# EAGLE design RGBCUBE16v1.0 (EAGLE 5.11)
BOM: EXCLUDE; PARTNO: *

## Sheet 1 of 4
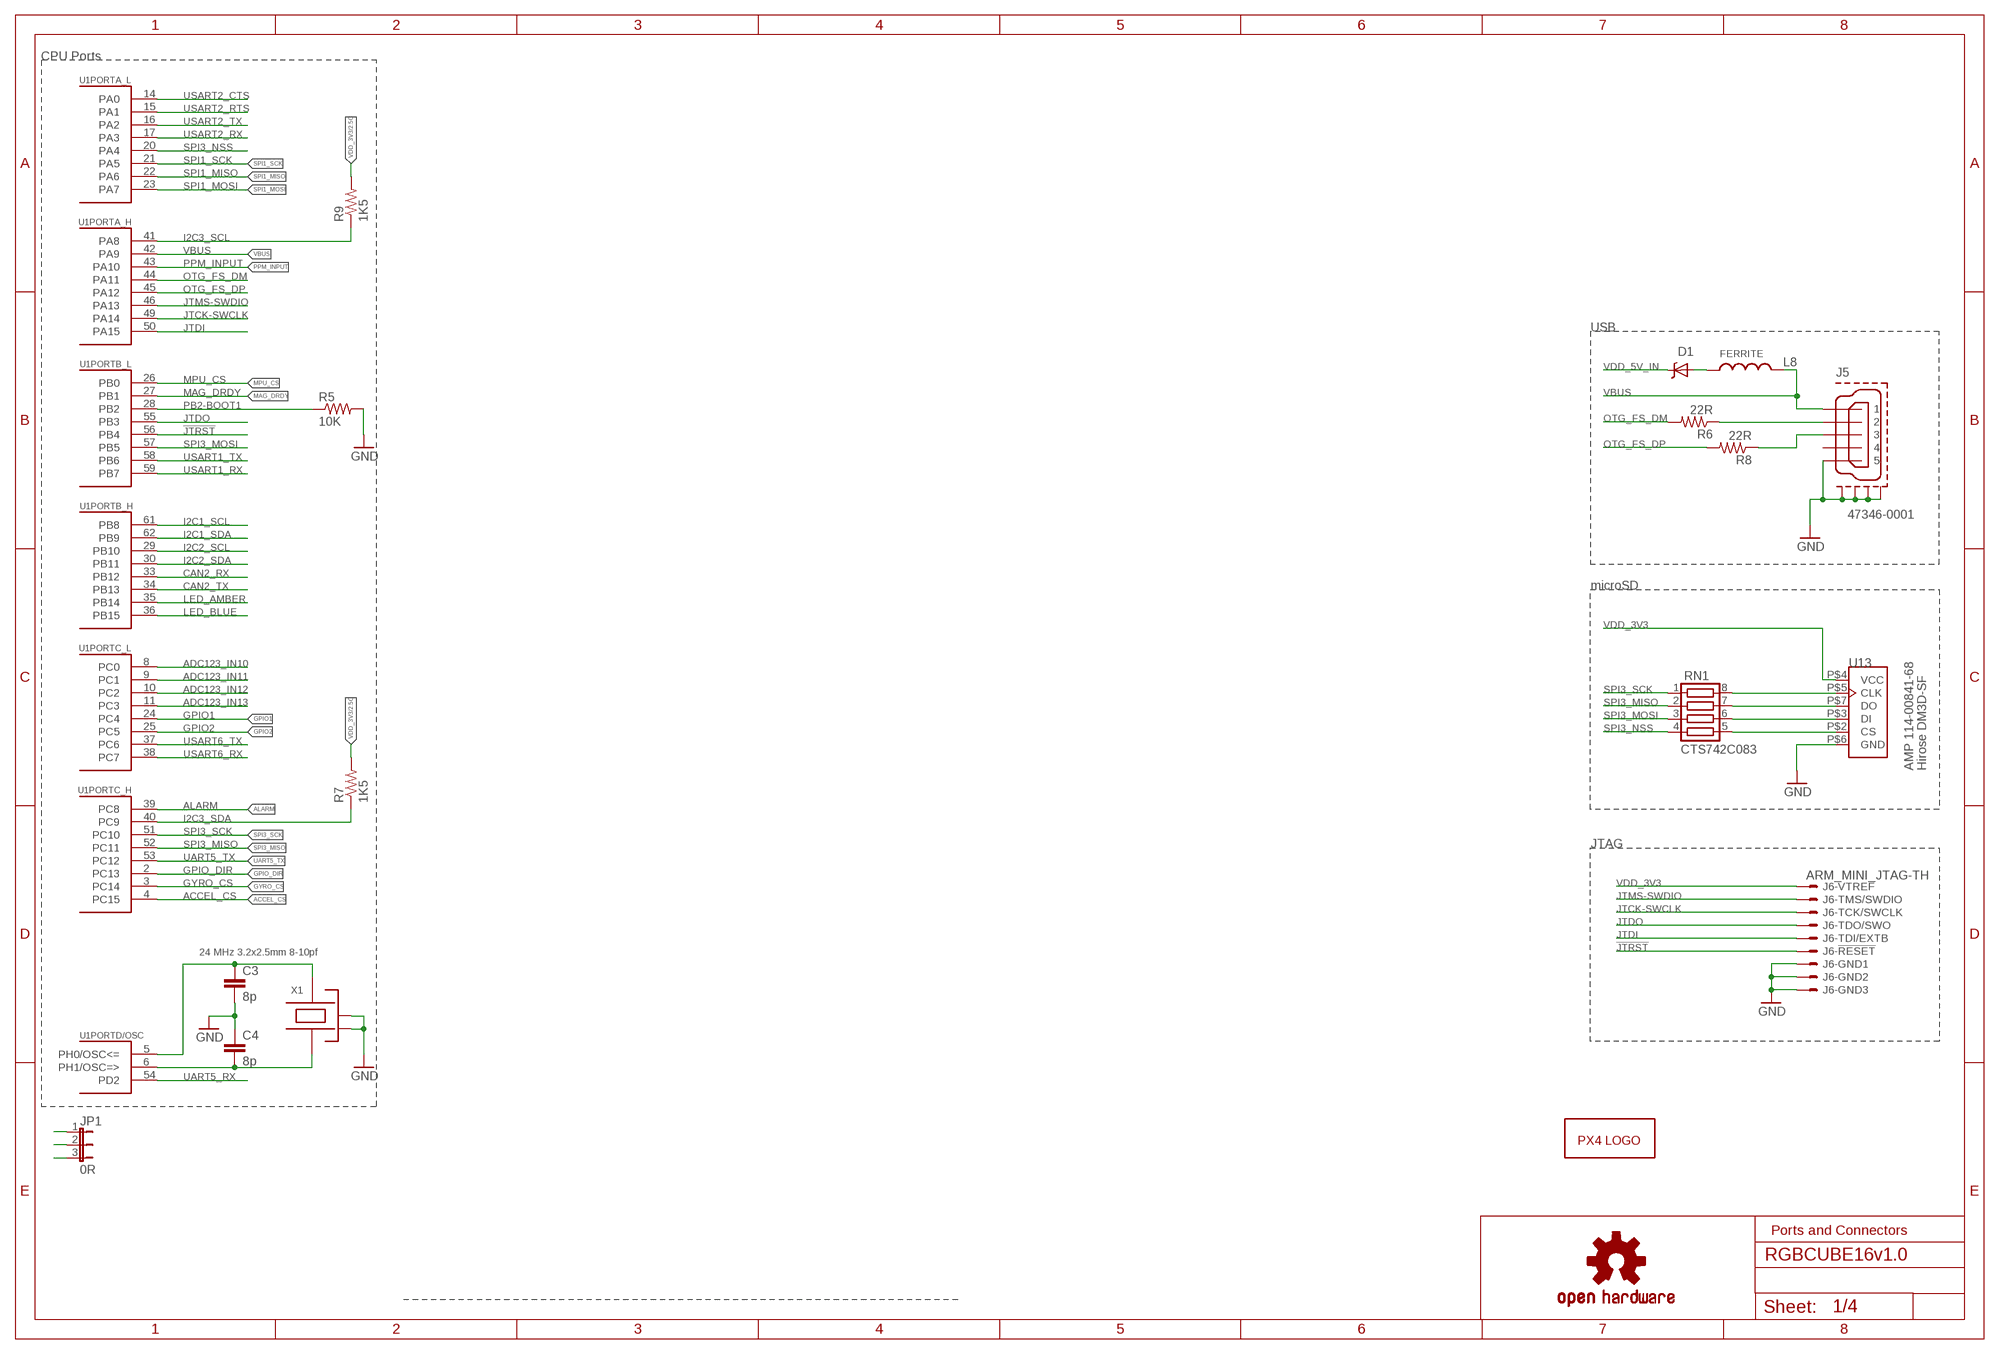
[diagram p0: schematic, sheet 1]

### Parts
C3  8p  CAP0402-CAP  [0402-CAP]
C4  8p  CAP0402-CAP  [0402-CAP]
D1  MSS1P4-M3  DIODE-SCHOTTKY_MSMP  [MICROSMP]
J5  47346-0001  MOLEX-47346-0001  [MOLEX-47346-0001]
J6  ARM_MINI_JTAG-TH  [FTSH-105-01-XXX-DV]
JP1  0R  JUMPER-30603  [SJ_3_0603_PASTE1&2]
L8  FERRITE  INDUCTOR0402  [0402-IND]
R5  10K  RESISTOR0402-RES  [0402-RES]
R6  22R  RESISTOR0402-RES  [0402-RES]
R7  1K5  RESISTOR0402-RES  [0402-RES]
R8  22R  RESISTOR0402-RES  [0402-RES]
R9  1K5  RESISTOR0402-RES  [0402-RES]
RN1  CTS742C083  [CTS742C083]
U1  STM32F405RGT6  STM32F20X_TQFP64  [TQFP64]
U13  AMP 114-00841-68  SF-MICROSDAMP-114-00841-68  [AMPHENOL_114-00841-68]
U$7  OSHW-LOGOS  [OSHW-LOGO-S]
U$13  PX4-LOGO-20MM  [PX4-LOGO-20MM]
X1  24 MHz 3.2x2.5mm 8-10pf  OSCILLATOR-3.2X2.5  [OSCILLATOR-3.2X2.5]

### Nets
!JTRST: J6.10 U1.56(PORTB_L:PB4)
ACCEL_CS: U1.4(PORTC_H:PC15)
ADC123_IN10: U1.8(PORTC_L:PC0)
ADC123_IN11: U1.9(PORTC_L:PC1)
ADC123_IN12: U1.10(PORTC_L:PC2)
ADC123_IN13: U1.11(PORTC_L:PC3)
ALARM: U1.39(PORTC_H:PC8)
CAN2_RX: U1.33(PORTB_H:PB12)
CAN2_TX: U1.34(PORTB_H:PB13)
GND [power]: C3.2 C4.1 J5.GND J5.GND1 J5.GND2 J5.GND3 J5.GND4 J6.3 J6.5 J6.9 R5.2 U13.P$6(GND) X1.2(NC_2) X1.4(NC_4) ; also sheet 2,3,4
GPIO1: U1.24(PORTC_L:PC4)
GPIO2: U1.25(PORTC_L:PC5)
GPIO_DIR: U1.2(PORTC_H:PC13)
GYRO_CS: U1.3(PORTC_H:PC14)
I2C1_SCL: U1.61(PORTB_H:PB8)
I2C1_SDA: U1.62(PORTB_H:PB9)
I2C2_SCL: U1.29(PORTB_H:PB10)
I2C2_SDA: U1.30(PORTB_H:PB11)
I2C3_SCL: R9.1 U1.41(PORTA_H:PA8)
I2C3_SDA: R7.1 U1.40(PORTC_H:PC9)
JTCK-SWCLK: J6.4 U1.49(PORTA_H:PA14)
JTDI: J6.8 U1.50(PORTA_H:PA15)
JTDO: J6.6 U1.55(PORTB_L:PB3)
JTMS-SWDIO: J6.2 U1.46(PORTA_H:PA13)
LED_AMBER: U1.35(PORTB_H:PB14) ; also sheet 2
LED_BLUE: U1.36(PORTB_H:PB15) ; also sheet 2
MAG_DRDY: U1.27(PORTB_L:PB1)
MPU_CS: U1.26(PORTB_L:PB0)
N$1: C4.2 U1.6(PORTD/OSC:PH1/OSC=>) X1.1
N$2: C3.1 U1.5(PORTD/OSC:PH0/OSC<=) X1.3
N$21: RN1.5 U13.P$2(CS)
N$23 [power]: D1.ANODE(A) L8.1
N$26: RN1.6 U13.P$3(DI)
N$31: RN1.7 U13.P$7(DO)
N$32: RN1.8 U13.P$5(CLK)
OTG_DM: J5.D- R6.1
OTG_DP: J5.D+ R8.1
OTG_FS_DM: R6.2 U1.44(PORTA_H:PA11)
OTG_FS_DP: R8.2 U1.45(PORTA_H:PA12)
PB2-BOOT1: R5.1 U1.28(PORTB_L:PB2)
PPM_INPUT: U1.43(PORTA_H:PA10)
SPI1_MISO: U1.22(PORTA_L:PA6)
SPI1_MOSI: U1.23(PORTA_L:PA7)
SPI1_SCK: U1.21(PORTA_L:PA5)
SPI3_MISO: RN1.2 U1.52(PORTC_H:PC11)
SPI3_MOSI: RN1.3 U1.57(PORTB_L:PB5)
SPI3_NSS: RN1.4 U1.20(PORTA_L:PA4)
SPI3_SCK: RN1.1 U1.51(PORTC_H:PC10)
UART5_RX: U1.54(PORTD/OSC:PD2)
UART5_TX: U1.53(PORTC_H:PC12)
USART1_RX: U1.59(PORTB_L:PB7)
USART1_TX: U1.58(PORTB_L:PB6)
USART2_CTS: U1.14(PORTA_L:PA0)
USART2_RTS: U1.15(PORTA_L:PA1)
USART2_RX: U1.17(PORTA_L:PA3)
USART2_TX: U1.16(PORTA_L:PA2)
USART6_RX: U1.38(PORTC_L:PC7)
USART6_TX: U1.37(PORTC_L:PC6)
VBUS [power]: J5.VBUS L8.2 U1.42(PORTA_H:PA9)
VDD_3V3 [power]: J6.1 JP1.1 R7.2 R9.2 U13.P$4(VCC) ; also sheet 2
VDD_5V [power]: JP1.3 ; also sheet 2,3,4
VDD_5V_IN [power]: D1.CATHODE(C) ; also sheet 2
VDD_IO [power]: JP1.2
Unconnected: J5.ID

### Notes on the sheet
- CPU Ports
- USB
- microSD
- Hirose DM3D-SF
- JTAG
- Ports and Connectors

## Sheet 2 of 4
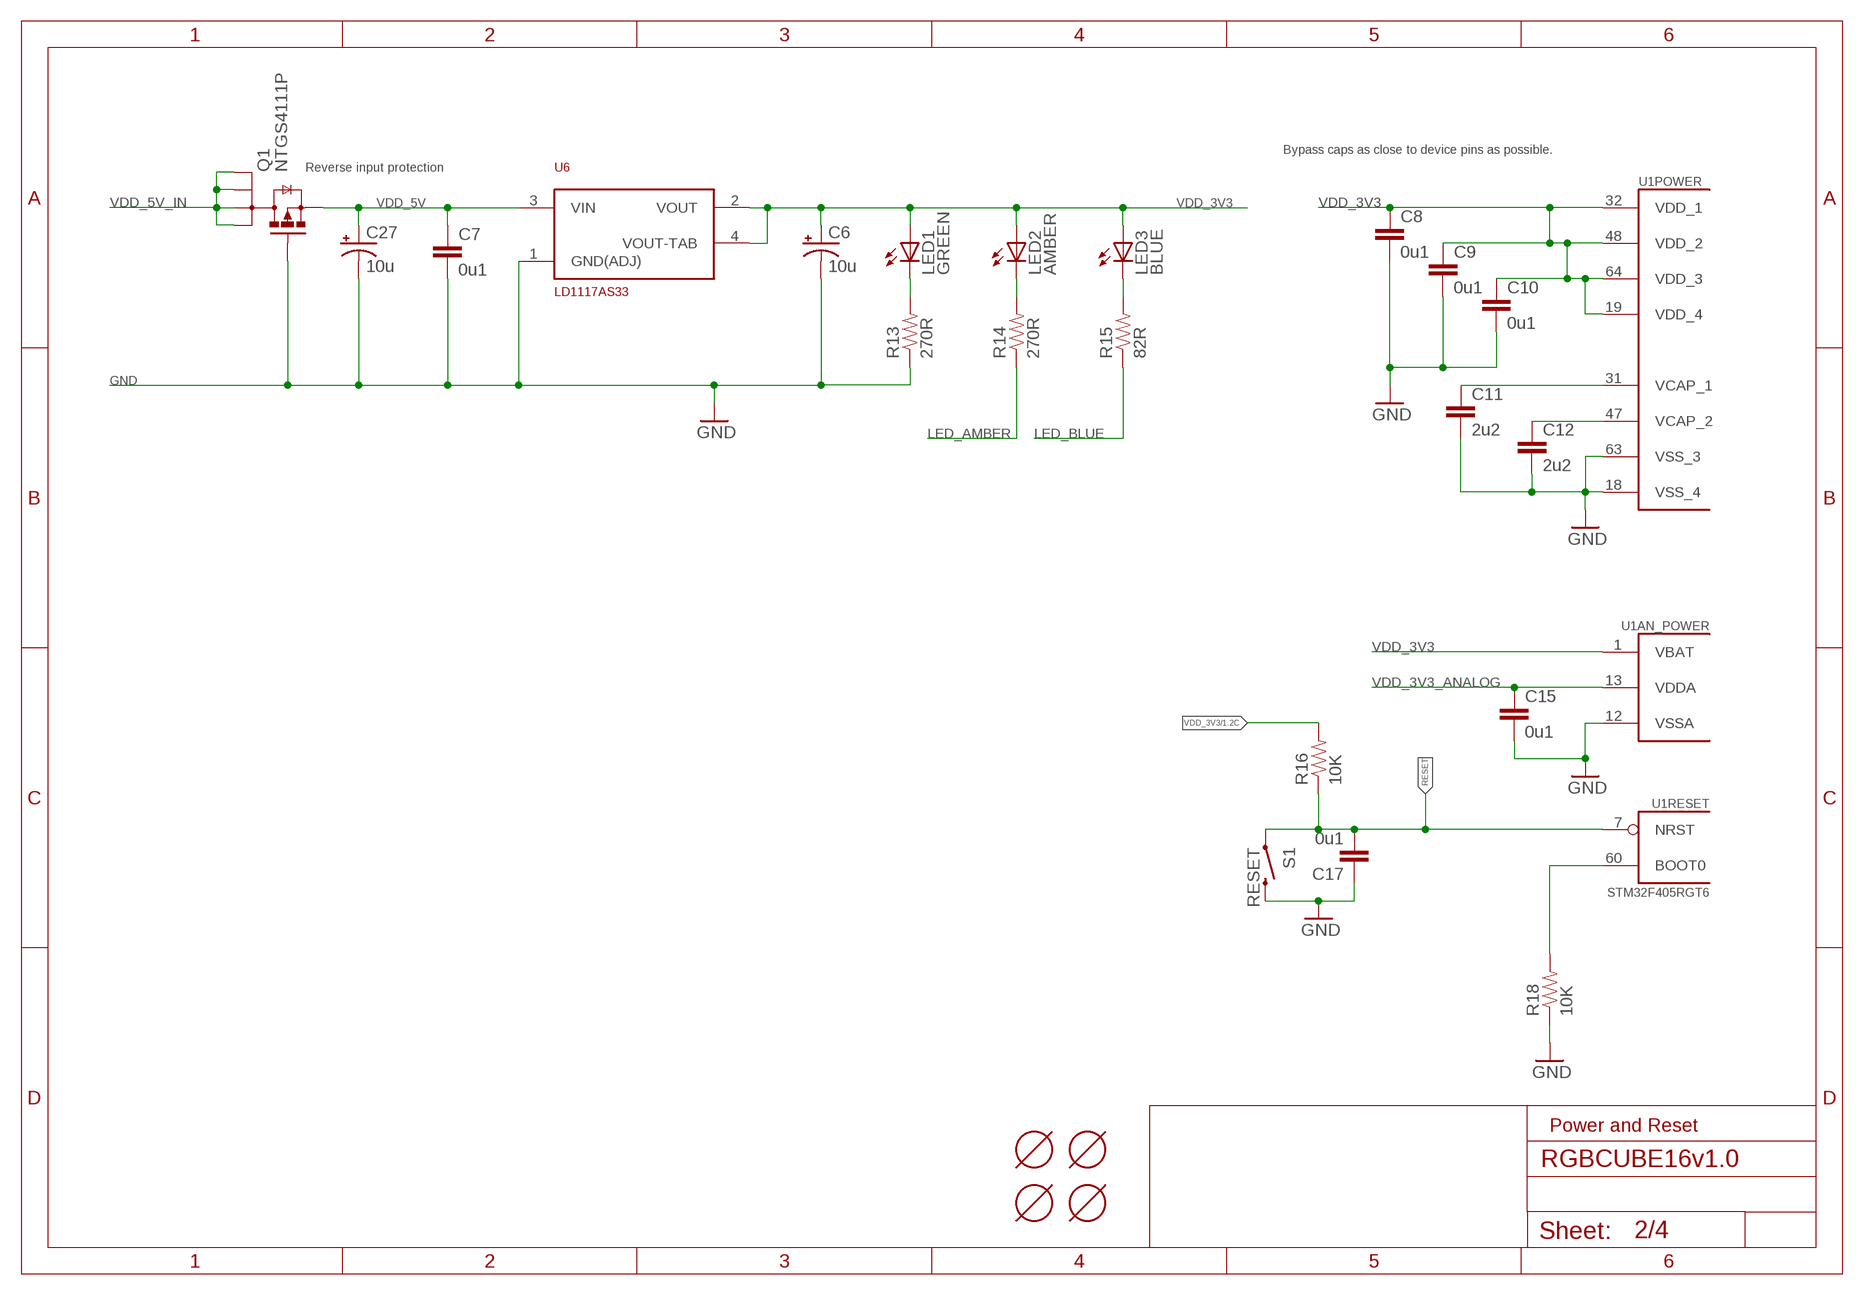
[diagram p1: schematic, sheet 2]

### Parts
C6  10u  CAP_POL1206  [EIA3216]
C7  0u1  CAP0402-CAP  [0402-CAP]
C8  0u1  CAP0402-CAP  [0402-CAP]
C9  0u1  CAP0402-CAP  [0402-CAP]
C10  0u1  CAP0402-CAP  [0402-CAP]
C11  2u2  CAP0402-CAP  [0402-CAP]
C12  2u2  CAP0402-CAP  [0402-CAP]
C15  0u1  CAP0402-CAP  [0402-CAP]
C17  0u1  CAP0402-CAP  [0402-CAP]
C27  10u  CAP_POL1206  [EIA3216]
LED1  GREEN  LED0603  [LED-0603]
LED2  AMBER  LED0603  [LED-0603]
LED3  BLUE  LED0603  [LED-0603]
Q1  NTGS4111P  [TSOP-6]
R13  270R  RESISTOR0402-RES  [0402-RES]
R14  270R  RESISTOR0402-RES  [0402-RES]
R15  82R  RESISTOR0402-RES  [0402-RES]
R16  10K  RESISTOR0402-RES  [0402-RES]
R18  10K  RESISTOR0402-RES  [0402-RES]
S1  RESET  SWITCH-MOMENTARY-2  [EVQP7J01K]
U6  LD1117AS33  [SOT-223]
U$1  MOUNT-HOLE3.1MM  [MOUNT-HOLE3.1]
U$2  MOUNT-HOLE3.1MM  [MOUNT-HOLE3.1]
U$3  MOUNT-HOLE3.1MM  [MOUNT-HOLE3.1]
U$4  MOUNT-HOLE3.1MM  [MOUNT-HOLE3.1]

### Nets
BOOT0: R18.2 U1.60(RESET:BOOT0)
GND [power]: C6.C(-) C7.2 C8.2 C9.2 C10.2 C11.2 C12.2 C15.2 C17.1 C27.C(-) Q1.3(G) R13.1 R18.1 S1.B3 U1.12(AN_POWER:VSSA) U1.18(POWER:VSS_4) U1.63(POWER:VSS_3) U6.1(GND(ADJ)) ; also sheet 1,3,4
LED_AMBER: R14.1 ; also sheet 1
LED_BLUE: R15.1 ; also sheet 1
N$28: LED3.C R15.2
N$29: LED1.C R13.2
N$30: LED2.C R14.2
RESET: C17.2 R16.1 S1.A1 U1.7(RESET:NRST)
VCAP_1: C11.1 U1.31(POWER:VCAP_1)
VCAP_2: C12.1 U1.47(POWER:VCAP_2)
VDD_3V3 [power]: C6.A(+) C8.1 C9.1 C10.1 LED1.A LED2.A LED3.A R16.2 U1.1(AN_POWER:VBAT) U1.19(POWER:VDD_4) U1.32(POWER:VDD_1) U1.48(POWER:VDD_2) U1.64(POWER:VDD_3) U6.2(VOUT) U6.4(VOUT-TAB) ; also sheet 1
VDD_3V3_ANALOG [power]: C15.1 U1.13(AN_POWER:VDDA)
VDD_5V [power]: C7.1 C27.A(+) Q1.4(S) U6.3(VIN) ; also sheet 1,3,4
VDD_5V_IN [power]: Q1.1(D) Q1.2(D1) Q1.5(D2) Q1.6(D3) ; also sheet 1

### Notes on the sheet
- Bypass caps as close to device pins as possible.
- Reverse input protection
- Power and Reset

## Sheet 3 of 4
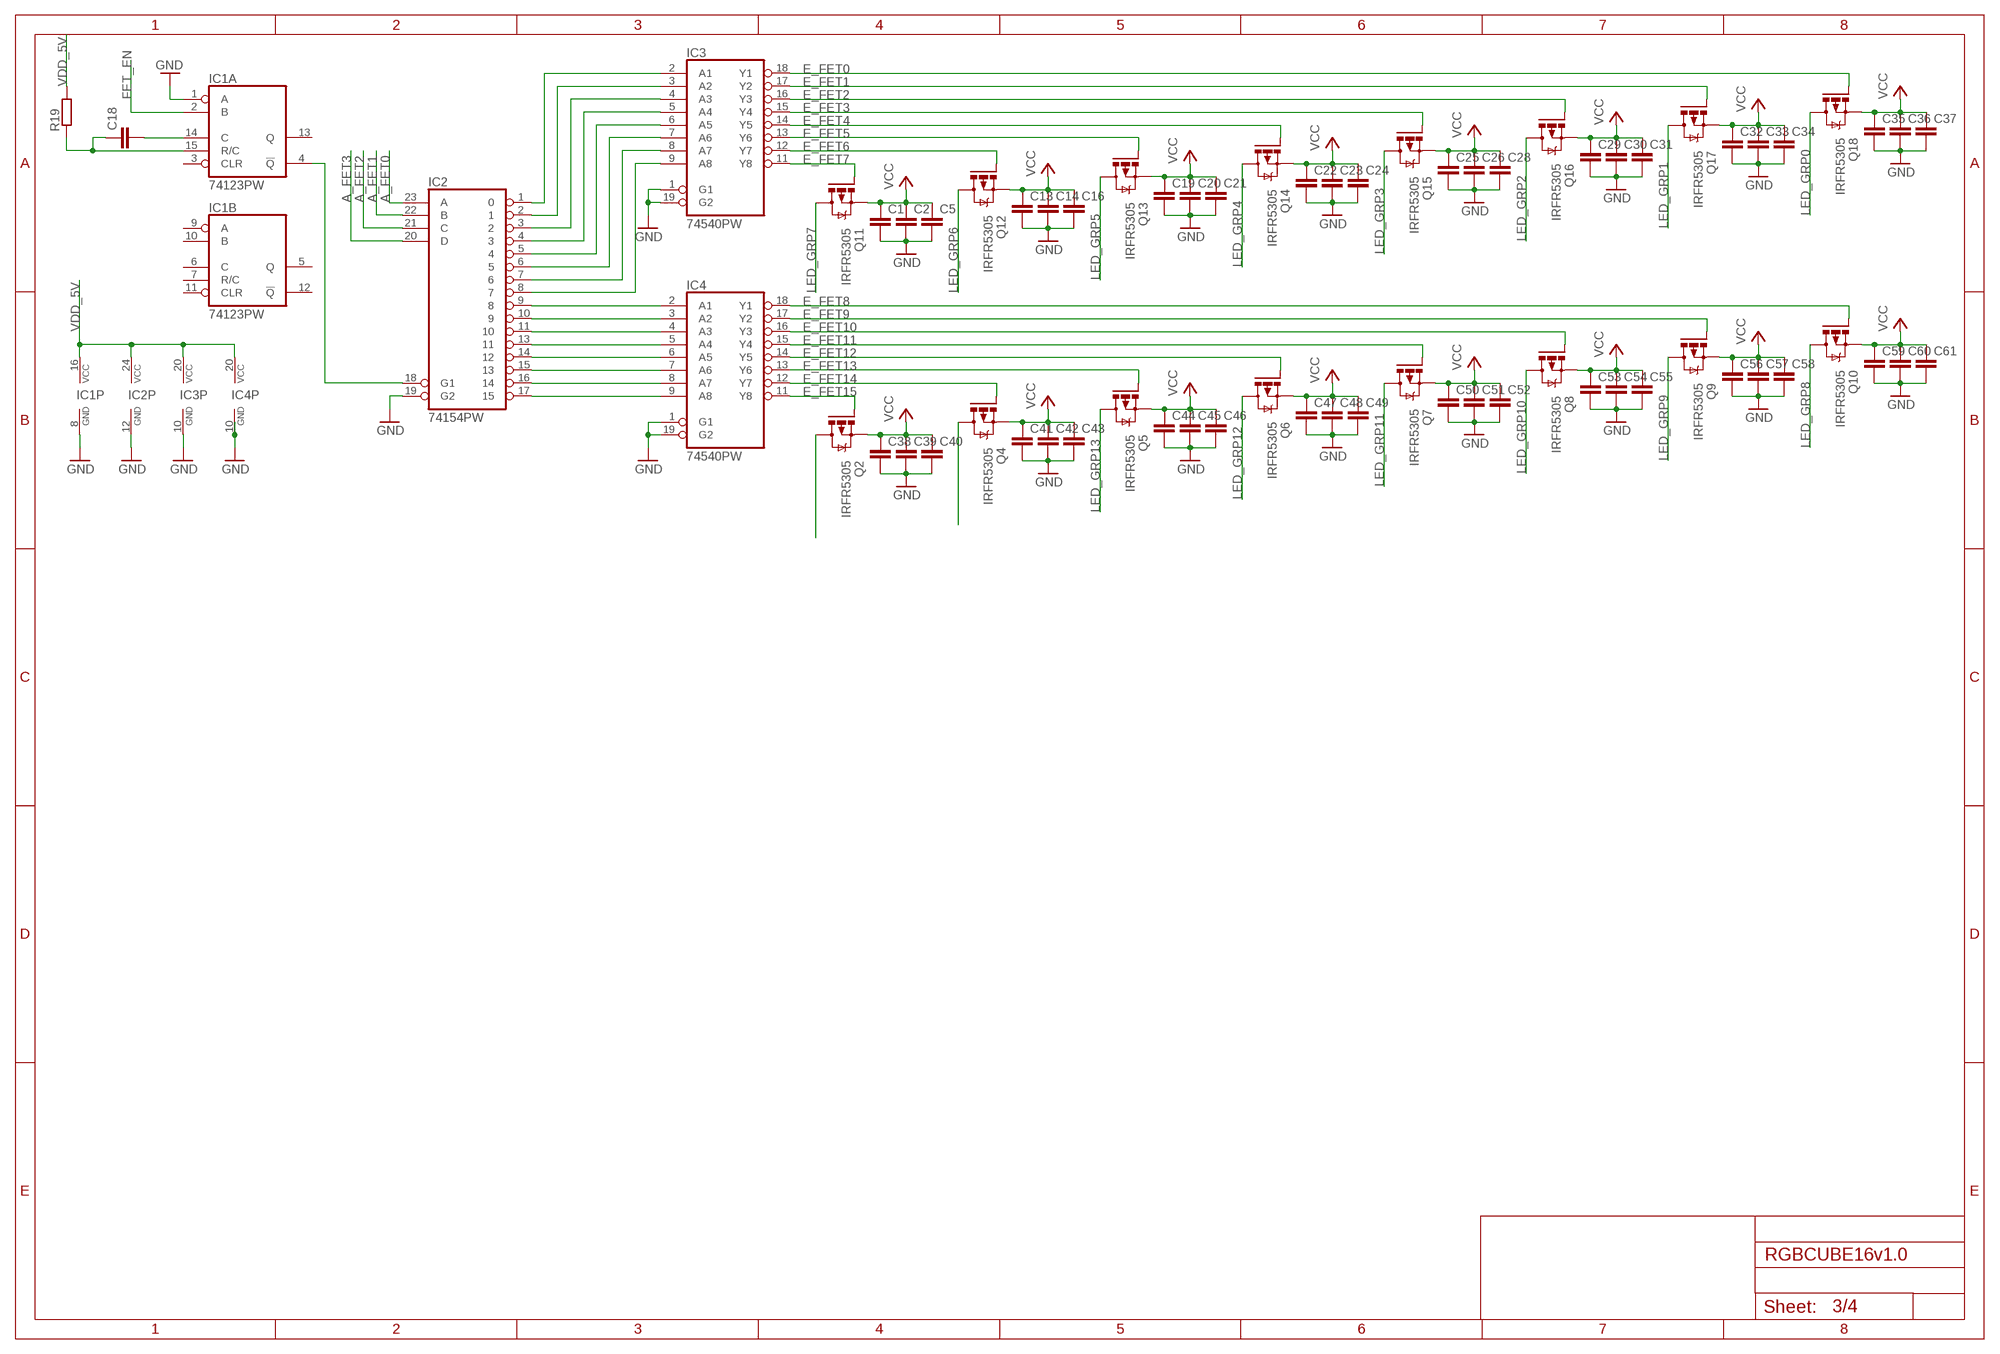
[diagram p2: schematic, sheet 3]

### Parts
C1  CAP0805  [0805]
C2  CAP0805  [0805]
C5  CAP0805  [0805]
C13  CAP0805  [0805]
C14  CAP0805  [0805]
C16  CAP0805  [0805]
C18  C-EUC0402  [C0402]
C19  CAP0805  [0805]
C20  CAP0805  [0805]
C21  CAP0805  [0805]
C22  CAP0805  [0805]
C23  CAP0805  [0805]
C24  CAP0805  [0805]
C25  CAP0805  [0805]
C26  CAP0805  [0805]
C28  CAP0805  [0805]
C29  CAP0805  [0805]
C30  CAP0805  [0805]
C31  CAP0805  [0805]
C32  CAP0805  [0805]
C33  CAP0805  [0805]
C34  CAP0805  [0805]
C35  CAP0805  [0805]
C36  CAP0805  [0805]
C37  CAP0805  [0805]
C38  CAP0805  [0805]
C39  CAP0805  [0805]
C40  CAP0805  [0805]
C41  CAP0805  [0805]
C42  CAP0805  [0805]
C43  CAP0805  [0805]
C44  CAP0805  [0805]
C45  CAP0805  [0805]
C46  CAP0805  [0805]
C47  CAP0805  [0805]
C48  CAP0805  [0805]
C49  CAP0805  [0805]
C50  CAP0805  [0805]
C51  CAP0805  [0805]
C52  CAP0805  [0805]
C53  CAP0805  [0805]
C54  CAP0805  [0805]
C55  CAP0805  [0805]
C56  CAP0805  [0805]
C57  CAP0805  [0805]
C58  CAP0805  [0805]
C59  CAP0805  [0805]
C60  CAP0805  [0805]
C61  CAP0805  [0805]
IC1  74123PW  [TSSOP-16]
IC2  74154PW  [TSSOP-24]
IC3  74540PW  [TSSOP-20]
IC4  74540PW  [TSSOP-20]
Q2  IRFR5305  [D-PAK_TO252AA]
Q4  IRFR5305  [D-PAK_TO252AA]
Q5  IRFR5305  [D-PAK_TO252AA]
Q6  IRFR5305  [D-PAK_TO252AA]
Q7  IRFR5305  [D-PAK_TO252AA]
Q8  IRFR5305  [D-PAK_TO252AA]
Q9  IRFR5305  [D-PAK_TO252AA]
Q10  IRFR5305  [D-PAK_TO252AA]
Q11  IRFR5305  [D-PAK_TO252AA]
Q12  IRFR5305  [D-PAK_TO252AA]
Q13  IRFR5305  [D-PAK_TO252AA]
Q14  IRFR5305  [D-PAK_TO252AA]
Q15  IRFR5305  [D-PAK_TO252AA]
Q16  IRFR5305  [D-PAK_TO252AA]
Q17  IRFR5305  [D-PAK_TO252AA]
Q18  IRFR5305  [D-PAK_TO252AA]
R19  R-EU_R0402  [R0402]

### Nets
A_FET0: IC2.23(:A)
A_FET1: IC2.22(:B)
A_FET2: IC2.21(:C)
A_FET3: IC2.20(:D)
E_FET0: IC3.18(:Y1) Q18.1(G)
E_FET1: IC3.17(:Y2) Q17.1(G)
E_FET2: IC3.16(:Y3) Q16.1(G)
E_FET3: IC3.15(:Y4) Q15.1(G)
E_FET4: IC3.14(:Y5) Q14.1(G)
E_FET5: IC3.13(:Y6) Q13.1(G)
E_FET6: IC3.12(:Y7) Q12.1(G)
E_FET7: IC3.11(:Y8) Q11.1(G)
E_FET8: IC4.18(:Y1) Q10.1(G)
E_FET9: IC4.17(:Y2) Q9.1(G)
E_FET10: IC4.16(:Y3) Q8.1(G)
E_FET11: IC4.15(:Y4) Q7.1(G)
E_FET12: IC4.14(:Y5) Q6.1(G)
E_FET13: IC4.13(:Y6) Q5.1(G)
E_FET14: IC4.12(:Y7) Q4.1(G)
E_FET15: IC4.11(:Y8) Q2.1(G)
FET_EN: IC1.2(A:B)
GND [power]: C1.2 C2.2 C5.2 C13.2 C14.2 C16.2 C19.2 C20.2 C21.2 C22.2 C23.2 C24.2 C25.2 C26.2 C28.2 C29.2 C30.2 C31.2 C32.2 C33.2 C34.2 C35.2 C36.2 C37.2 C38.2 C39.2 C40.2 C41.2 C42.2 C43.2 C44.2 C45.2 C46.2 C47.2 C48.2 C49.2 C50.2 C51.2 C52.2 C53.2 C54.2 C55.2 C56.2 C57.2 C58.2 C59.2 C60.2 C61.2 IC1.1(A:A) IC1.8(P:GND) IC2.12(P:GND) IC2.19(:G2) IC3.1(:G1) IC3.10(P:GND) IC3.19(:G2) IC4.1(:G1) IC4.10(P:GND) IC4.19(:G2) ; also sheet 1,2,4
LED_GRP0: Q18.4(D)
LED_GRP1: Q17.4(D)
LED_GRP2: Q16.4(D)
LED_GRP3: Q15.4(D)
LED_GRP4: Q14.4(D)
LED_GRP5: Q13.4(D)
LED_GRP6: Q12.4(D)
LED_GRP7: Q11.4(D)
LED_GRP8: Q10.4(D)
LED_GRP9: Q9.4(D)
LED_GRP10: Q8.4(D)
LED_GRP11: Q7.4(D)
LED_GRP12: Q6.4(D)
LED_GRP13: Q5.4(D)
LED_GRP14: Q4.4(D)
LED_GRP15: Q2.4(D)
N$3: C18.2 IC1.14(A:C)
N$6: IC2.1 IC3.2(:A1)
N$7: IC2.2 IC3.3(:A2)
N$10: IC2.4 IC3.5(:A4)
N$17: IC2.3 IC3.4(:A3)
N$19: IC2.5 IC3.6(:A5)
N$22: IC2.6 IC3.7(:A6)
N$33: IC2.7 IC3.8(:A7)
N$34: IC2.8 IC3.9(:A8)
N$36: IC2.9 IC4.2(:A1)
N$37: IC2.10 IC4.3(:A2)
N$38: IC2.11 IC4.4(:A3)
N$39: IC2.13 IC4.5(:A4)
N$40: IC2.14 IC4.6(:A5)
N$42: IC2.15 IC4.7(:A6)
N$43: IC2.16 IC4.8(:A7)
N$44: IC2.17 IC4.9(:A8)
N$45: IC1.4(A:!Q) IC2.18(:G1)
N$47: C18.1 IC1.15(A:R/C) R19.1
VCC: C1.1 C2.1 C5.1 C13.1 C14.1 C16.1 C19.1 C20.1 C21.1 C22.1 C23.1 C24.1 C25.1 C26.1 C28.1 C29.1 C30.1 C31.1 C32.1 C33.1 C34.1 C35.1 C36.1 C37.1 C38.1 C39.1 C40.1 C41.1 C42.1 C43.1 C44.1 C45.1 C46.1 C47.1 C48.1 C49.1 C50.1 C51.1 C52.1 C53.1 C54.1 C55.1 C56.1 C57.1 C58.1 C59.1 C60.1 C61.1 Q2.3(S) Q4.3(S) Q5.3(S) Q6.3(S) Q7.3(S) Q8.3(S) Q9.3(S) Q10.3(S) Q11.3(S) Q12.3(S) Q13.3(S) Q14.3(S) Q15.3(S) Q16.3(S) Q17.3(S) Q18.3(S)
VDD_5V [power]: IC1.16(P:VCC) IC2.24(P:VCC) IC3.20(P:VCC) IC4.20(P:VCC) R19.2 ; also sheet 1,2,4
Unconnected: IC1.3(A:CLR) IC1.5(B:Q) IC1.6(B:C) IC1.7(B:R/C) IC1.9(B:A) IC1.10(B:B) IC1.11(B:CLR) IC1.12(B:!Q) IC1.13(A:Q)

## Sheet 4 of 4
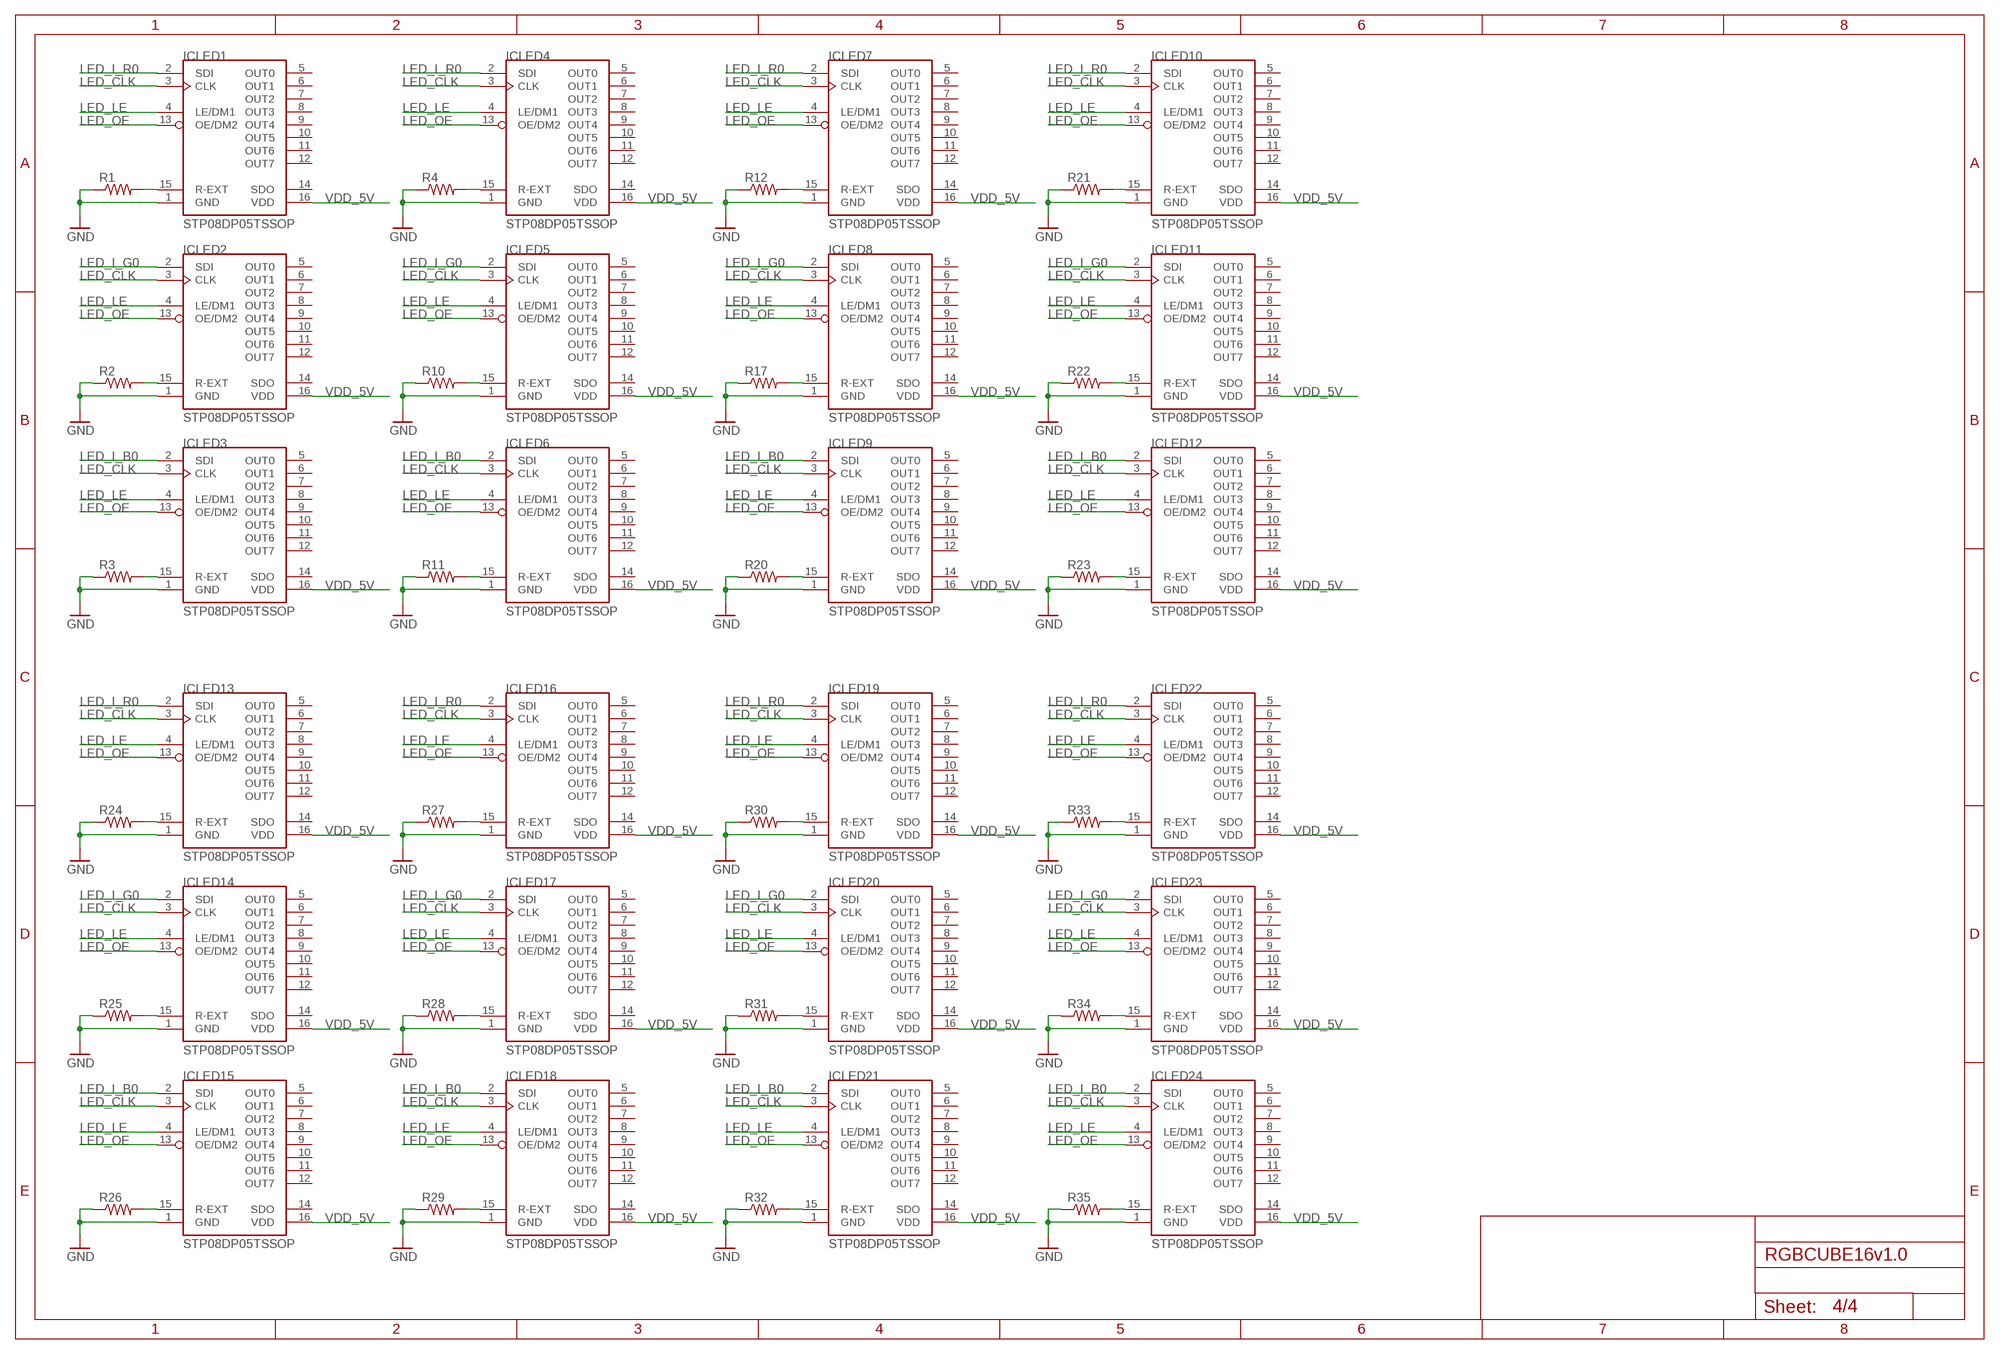
[diagram p3: schematic, sheet 4]

### Parts
ICLED1  STP08DP05TSSOP  [TSSOP-16]
ICLED2  STP08DP05TSSOP  [TSSOP-16]
ICLED3  STP08DP05TSSOP  [TSSOP-16]
ICLED4  STP08DP05TSSOP  [TSSOP-16]
ICLED5  STP08DP05TSSOP  [TSSOP-16]
ICLED6  STP08DP05TSSOP  [TSSOP-16]
ICLED7  STP08DP05TSSOP  [TSSOP-16]
ICLED8  STP08DP05TSSOP  [TSSOP-16]
ICLED9  STP08DP05TSSOP  [TSSOP-16]
ICLED10  STP08DP05TSSOP  [TSSOP-16]
ICLED11  STP08DP05TSSOP  [TSSOP-16]
ICLED12  STP08DP05TSSOP  [TSSOP-16]
ICLED13  STP08DP05TSSOP  [TSSOP-16]
ICLED14  STP08DP05TSSOP  [TSSOP-16]
ICLED15  STP08DP05TSSOP  [TSSOP-16]
ICLED16  STP08DP05TSSOP  [TSSOP-16]
ICLED17  STP08DP05TSSOP  [TSSOP-16]
ICLED18  STP08DP05TSSOP  [TSSOP-16]
ICLED19  STP08DP05TSSOP  [TSSOP-16]
ICLED20  STP08DP05TSSOP  [TSSOP-16]
ICLED21  STP08DP05TSSOP  [TSSOP-16]
ICLED22  STP08DP05TSSOP  [TSSOP-16]
ICLED23  STP08DP05TSSOP  [TSSOP-16]
ICLED24  STP08DP05TSSOP  [TSSOP-16]
R1  RESISTOR  [0805]
R2  RESISTOR  [0805]
R3  RESISTOR  [0805]
R4  RESISTOR  [0805]
R10  RESISTOR  [0805]
R11  RESISTOR  [0805]
R12  RESISTOR  [0805]
R17  RESISTOR  [0805]
R20  RESISTOR  [0805]
R21  RESISTOR  [0805]
R22  RESISTOR  [0805]
R23  RESISTOR  [0805]
R24  RESISTOR  [0805]
R25  RESISTOR  [0805]
R26  RESISTOR  [0805]
R27  RESISTOR  [0805]
R28  RESISTOR  [0805]
R29  RESISTOR  [0805]
R30  RESISTOR  [0805]
R31  RESISTOR  [0805]
R32  RESISTOR  [0805]
R33  RESISTOR  [0805]
R34  RESISTOR  [0805]
R35  RESISTOR  [0805]

### Nets
GND [power]: ICLED1.1(GND) ICLED2.1(GND) ICLED3.1(GND) ICLED4.1(GND) ICLED5.1(GND) ICLED6.1(GND) ICLED7.1(GND) ICLED8.1(GND) ICLED9.1(GND) ICLED10.1(GND) ICLED11.1(GND) ICLED12.1(GND) ICLED13.1(GND) ICLED14.1(GND) ICLED15.1(GND) ICLED16.1(GND) ICLED17.1(GND) ICLED18.1(GND) ICLED19.1(GND) ICLED20.1(GND) ICLED21.1(GND) ICLED22.1(GND) ICLED23.1(GND) ICLED24.1(GND) R1.1 R2.1 R3.1 R4.1 R10.1 R11.1 R12.1 R17.1 R20.1 R21.1 R22.1 R23.1 R24.1 R25.1 R26.1 R27.1 R28.1 R29.1 R30.1 R31.1 R32.1 R33.1 R34.1 R35.1 ; also sheet 1,2,3
LED_CLK: ICLED1.3(CLK) ICLED2.3(CLK) ICLED3.3(CLK) ICLED4.3(CLK) ICLED5.3(CLK) ICLED6.3(CLK) ICLED7.3(CLK) ICLED8.3(CLK) ICLED9.3(CLK) ICLED10.3(CLK) ICLED11.3(CLK) ICLED12.3(CLK) ICLED13.3(CLK) ICLED14.3(CLK) ICLED15.3(CLK) ICLED16.3(CLK) ICLED17.3(CLK) ICLED18.3(CLK) ICLED19.3(CLK) ICLED20.3(CLK) ICLED21.3(CLK) ICLED22.3(CLK) ICLED23.3(CLK) ICLED24.3(CLK)
LED_I_B0: ICLED3.2(SDI) ICLED6.2(SDI) ICLED9.2(SDI) ICLED12.2(SDI) ICLED15.2(SDI) ICLED18.2(SDI) ICLED21.2(SDI) ICLED24.2(SDI)
LED_I_G0: ICLED2.2(SDI) ICLED5.2(SDI) ICLED8.2(SDI) ICLED11.2(SDI) ICLED14.2(SDI) ICLED17.2(SDI) ICLED20.2(SDI) ICLED23.2(SDI)
LED_I_R0: ICLED1.2(SDI) ICLED4.2(SDI) ICLED7.2(SDI) ICLED10.2(SDI) ICLED13.2(SDI) ICLED16.2(SDI) ICLED19.2(SDI) ICLED22.2(SDI)
LED_LE: ICLED1.4(LE/DM1) ICLED2.4(LE/DM1) ICLED3.4(LE/DM1) ICLED4.4(LE/DM1) ICLED5.4(LE/DM1) ICLED6.4(LE/DM1) ICLED7.4(LE/DM1) ICLED8.4(LE/DM1) ICLED9.4(LE/DM1) ICLED10.4(LE/DM1) ICLED11.4(LE/DM1) ICLED12.4(LE/DM1) ICLED13.4(LE/DM1) ICLED14.4(LE/DM1) ICLED15.4(LE/DM1) ICLED16.4(LE/DM1) ICLED17.4(LE/DM1) ICLED18.4(LE/DM1) ICLED19.4(LE/DM1) ICLED20.4(LE/DM1) ICLED21.4(LE/DM1) ICLED22.4(LE/DM1) ICLED23.4(LE/DM1) ICLED24.4(LE/DM1)
LED_OE: ICLED1.13(OE/DM2) ICLED2.13(OE/DM2) ICLED3.13(OE/DM2) ICLED4.13(OE/DM2) ICLED5.13(OE/DM2) ICLED6.13(OE/DM2) ICLED7.13(OE/DM2) ICLED8.13(OE/DM2) ICLED9.13(OE/DM2) ICLED10.13(OE/DM2) ICLED11.13(OE/DM2) ICLED12.13(OE/DM2) ICLED13.13(OE/DM2) ICLED14.13(OE/DM2) ICLED15.13(OE/DM2) ICLED16.13(OE/DM2) ICLED17.13(OE/DM2) ICLED18.13(OE/DM2) ICLED19.13(OE/DM2) ICLED20.13(OE/DM2) ICLED21.13(OE/DM2) ICLED22.13(OE/DM2) ICLED23.13(OE/DM2) ICLED24.13(OE/DM2)
N$4 [power]: ICLED1.15(R-EXT) R1.2
N$5: ICLED5.15(R-EXT) R10.2
N$8: ICLED6.15(R-EXT) R11.2
N$9 [power]: ICLED4.15(R-EXT) R4.2
N$11: ICLED8.15(R-EXT) R17.2
N$12: ICLED9.15(R-EXT) R20.2
N$13: ICLED2.15(R-EXT) R2.2
N$14 [power]: ICLED7.15(R-EXT) R12.2
N$15: ICLED3.15(R-EXT) R3.2
N$16: ICLED11.15(R-EXT) R22.2
N$18: ICLED12.15(R-EXT) R23.2
N$20 [power]: ICLED10.15(R-EXT) R21.2
N$24: ICLED14.15(R-EXT) R25.2
N$25: ICLED15.15(R-EXT) R26.2
N$27 [power]: ICLED13.15(R-EXT) R24.2
N$35: ICLED17.15(R-EXT) R28.2
N$41: ICLED18.15(R-EXT) R29.2
N$46 [power]: ICLED16.15(R-EXT) R27.2
N$48: ICLED20.15(R-EXT) R31.2
N$49: ICLED21.15(R-EXT) R32.2
N$50 [power]: ICLED19.15(R-EXT) R30.2
N$51: ICLED23.15(R-EXT) R34.2
N$52: ICLED24.15(R-EXT) R35.2
N$53 [power]: ICLED22.15(R-EXT) R33.2
VDD_5V [power]: ICLED1.16(VDD) ICLED2.16(VDD) ICLED3.16(VDD) ICLED4.16(VDD) ICLED5.16(VDD) ICLED6.16(VDD) ICLED7.16(VDD) ICLED8.16(VDD) ICLED9.16(VDD) ICLED10.16(VDD) ICLED11.16(VDD) ICLED12.16(VDD) ICLED13.16(VDD) ICLED14.16(VDD) ICLED15.16(VDD) ICLED16.16(VDD) ICLED17.16(VDD) ICLED18.16(VDD) ICLED19.16(VDD) ICLED20.16(VDD) ICLED21.16(VDD) ICLED22.16(VDD) ICLED23.16(VDD) ICLED24.16(VDD) ; also sheet 1,2,3
Unconnected: ICLED1.5(OUT0) ICLED1.6(OUT1) ICLED1.7(OUT2) ICLED1.8(OUT3) ICLED1.9(OUT4) ICLED1.10(OUT5) ICLED1.11(OUT6) ICLED1.12(OUT7) ICLED1.14(SDO) ICLED2.5(OUT0) ICLED2.6(OUT1) ICLED2.7(OUT2) ICLED2.8(OUT3) ICLED2.9(OUT4) ICLED2.10(OUT5) ICLED2.11(OUT6) ICLED2.12(OUT7) ICLED2.14(SDO) ICLED3.5(OUT0) ICLED3.6(OUT1) ICLED3.7(OUT2) ICLED3.8(OUT3) ICLED3.9(OUT4) ICLED3.10(OUT5) ICLED3.11(OUT6) ICLED3.12(OUT7) ICLED3.14(SDO) ICLED4.5(OUT0) ICLED4.6(OUT1) ICLED4.7(OUT2) ICLED4.8(OUT3) ICLED4.9(OUT4) ICLED4.10(OUT5) ICLED4.11(OUT6) ICLED4.12(OUT7) ICLED4.14(SDO) ICLED5.5(OUT0) ICLED5.6(OUT1) ICLED5.7(OUT2) ICLED5.8(OUT3) ICLED5.9(OUT4) ICLED5.10(OUT5) ICLED5.11(OUT6) ICLED5.12(OUT7) ICLED5.14(SDO) ICLED6.5(OUT0) ICLED6.6(OUT1) ICLED6.7(OUT2) ICLED6.8(OUT3) ICLED6.9(OUT4) ICLED6.10(OUT5) ICLED6.11(OUT6) ICLED6.12(OUT7) ICLED6.14(SDO) ICLED7.5(OUT0) ICLED7.6(OUT1) ICLED7.7(OUT2) ICLED7.8(OUT3) ICLED7.9(OUT4) ICLED7.10(OUT5) ICLED7.11(OUT6) ICLED7.12(OUT7) ICLED7.14(SDO) ICLED8.5(OUT0) ICLED8.6(OUT1) ICLED8.7(OUT2) ICLED8.8(OUT3) ICLED8.9(OUT4) ICLED8.10(OUT5) ICLED8.11(OUT6) ICLED8.12(OUT7) ICLED8.14(SDO) ICLED9.5(OUT0) ICLED9.6(OUT1) ICLED9.7(OUT2) ICLED9.8(OUT3) ICLED9.9(OUT4) ICLED9.10(OUT5) ICLED9.11(OUT6) ICLED9.12(OUT7) ICLED9.14(SDO) ICLED10.5(OUT0) ICLED10.6(OUT1) ICLED10.7(OUT2) ICLED10.8(OUT3) ICLED10.9(OUT4) ICLED10.10(OUT5) ICLED10.11(OUT6) ICLED10.12(OUT7) ICLED10.14(SDO) ICLED11.5(OUT0) ICLED11.6(OUT1) ICLED11.7(OUT2) ICLED11.8(OUT3) ICLED11.9(OUT4) ICLED11.10(OUT5) ICLED11.11(OUT6) ICLED11.12(OUT7) ICLED11.14(SDO) ICLED12.5(OUT0) ICLED12.6(OUT1) ICLED12.7(OUT2) ICLED12.8(OUT3) ICLED12.9(OUT4) ICLED12.10(OUT5) ICLED12.11(OUT6) ICLED12.12(OUT7) ICLED12.14(SDO) ICLED13.5(OUT0) ICLED13.6(OUT1) ICLED13.7(OUT2) ICLED13.8(OUT3) ICLED13.9(OUT4) ICLED13.10(OUT5) ICLED13.11(OUT6) ICLED13.12(OUT7) ICLED13.14(SDO) ICLED14.5(OUT0) ICLED14.6(OUT1) ICLED14.7(OUT2) ICLED14.8(OUT3) ICLED14.9(OUT4) ICLED14.10(OUT5) ICLED14.11(OUT6) ICLED14.12(OUT7) ICLED14.14(SDO) ICLED15.5(OUT0) ICLED15.6(OUT1) ICLED15.7(OUT2) ICLED15.8(OUT3) ICLED15.9(OUT4) ICLED15.10(OUT5) ICLED15.11(OUT6) ICLED15.12(OUT7) ICLED15.14(SDO) ICLED16.5(OUT0) ICLED16.6(OUT1) ICLED16.7(OUT2) ICLED16.8(OUT3) ICLED16.9(OUT4) ICLED16.10(OUT5) ICLED16.11(OUT6) ICLED16.12(OUT7) ICLED16.14(SDO) ICLED17.5(OUT0) ICLED17.6(OUT1) ICLED17.7(OUT2) ICLED17.8(OUT3) ICLED17.9(OUT4) ICLED17.10(OUT5) ICLED17.11(OUT6) ICLED17.12(OUT7) ICLED17.14(SDO) ICLED18.5(OUT0) ICLED18.6(OUT1) ICLED18.7(OUT2) ICLED18.8(OUT3) ICLED18.9(OUT4) ICLED18.10(OUT5) ICLED18.11(OUT6) ICLED18.12(OUT7) ICLED18.14(SDO) ICLED19.5(OUT0) ICLED19.6(OUT1) ICLED19.7(OUT2) ICLED19.8(OUT3) ICLED19.9(OUT4) ICLED19.10(OUT5) ICLED19.11(OUT6) ICLED19.12(OUT7) ICLED19.14(SDO) ICLED20.5(OUT0) ICLED20.6(OUT1) ICLED20.7(OUT2) ICLED20.8(OUT3) ICLED20.9(OUT4) ICLED20.10(OUT5) ICLED20.11(OUT6) ICLED20.12(OUT7) ICLED20.14(SDO) ICLED21.5(OUT0) ICLED21.6(OUT1) ICLED21.7(OUT2) ICLED21.8(OUT3) ICLED21.9(OUT4) ICLED21.10(OUT5) ICLED21.11(OUT6) ICLED21.12(OUT7) ICLED21.14(SDO) ICLED22.5(OUT0) ICLED22.6(OUT1) ICLED22.7(OUT2) ICLED22.8(OUT3) ICLED22.9(OUT4) ICLED22.10(OUT5) ICLED22.11(OUT6) ICLED22.12(OUT7) ICLED22.14(SDO) ICLED23.5(OUT0) ICLED23.6(OUT1) ICLED23.7(OUT2) ICLED23.8(OUT3) ICLED23.9(OUT4) ICLED23.10(OUT5) ICLED23.11(OUT6) ICLED23.12(OUT7) ICLED23.14(SDO) ICLED24.5(OUT0) ICLED24.6(OUT1) ICLED24.7(OUT2) ICLED24.8(OUT3) ICLED24.9(OUT4) ICLED24.10(OUT5) ICLED24.11(OUT6) ICLED24.12(OUT7) ICLED24.14(SDO)

## Library data of the parts
C1 C2 C5 C13 C14 C16 C19-C26 C28-C61 = rgb_cube:CAP: Capacitor Standard 0603 ceramic capacitor, and 0.1" leaded capacitor.
C3 C4 C7-C12 C15 C17 = pixhawk2:CAP: Capacitor Standard 0603 ceramic capacitor, and 0.1" leaded capacitor.
C6 C27 = pixhawk2:CAP_POL: Capacitor Polarized These are standard SMD and PTH capacitors. Normally 10uF, 47uF, and 100uF in electrolytic and tantalum varieties. Always verify the external diameter of the through hole cap, it varies with capacity, voltage, and manufacturer. The EIA devices should be standard.
C18 = resistor:C-EU: CAPACITOR, European symbol
D1 = pixhawk2:DIODE-SCHOTTKY: Schottky barrier diode in DO214AC, e.g. Fairchild SS14.
IC1 = rgb_cube:74123
IC2 = rgb_cube:74154
IC3 IC4 = rgb_cube:74540
ICLED1-ICLED24 = rgb_cube:STP08DP05
J5 = pixhawk2:MOLEX-47346-0001: MICRO USB B, BOTTOM MOUNT
J6 = pixhawk2:ARM_MINI_JTAG: CONNECTOR wire to board 1.25 mm (.049 inch) pitch header
JP1 = pixhawk2:JUMPER-3
L8 = pixhawk2:INDUCTOR: Inductors Basic Inductor/Choke - 0603 and 1206. Footprints are not proven and vary greatly between part numbers.
LED1-LED3 = pixhawk2:LED: LEDs Standard schematic elements and footprints for 5mm, 3mm, 1206, and 0603 sized LEDs. 5mm - Spark Fun Electronics SKU : COM-00529 (and others)
Q1 = pixhawk2:NTGS4111P
Q2 Q4-Q18 = transistor-power:IRF?5305: HEXFET Power MOSFET Source: http://www.irf.com/product-info/datasheets/data/irfr5305pbf.pdf
R1-R4 R10-R12 R17 R20-R35 = rgb_cube:RESISTOR: Resistor Basic schematic elements and footprints for 0603, 1206, and PTH 1/10th watt (small) resistors.
R5-R9 R13-R16 R18 = pixhawk2:RESISTOR: Resistor Basic schematic elements and footprints for 0603, 1206, and PTH 1/10th watt (small) resistors.
R19 = resistor:R-EU_: RESISTOR, European symbol
RN1 = pixhawk2:CTS742C083: Chip Resistor Array 4 Single Resistor Source: http://www.ctscorp.com/components/Datasheets/CTSChipArrayDs.pdf; OC_FARNELL: unknown; OC_NEWARK: unknown
S1 = pixhawk2:SWITCH-MOMENTARY-2
U1 = pixhawk2:STM32F20X_TQFP64: STM32F20x 64pin LQFP
U6 = pixhawk2:LD1117A: LD1117A LDO Datasheet: http://www.st.com/stonline/books/pdf/docs/7194.pdf
U13 = pixhawk2:SF-MICROSD
U$1-U$4 = pixhawk2:MOUNT-HOLE
U$7 = pixhawk2:OSHW-LOGO: Open Source Hardware Logo This logo indicates the piece of hardware it is found on incorporates a OSHW license and/or adheres to the definition of open source hardware found here: http://freedomdefined.org/OSHW
U$13 = pixhawk2:PX4-LOGO
X1 = pixhawk2:OSCILLATOR: Crystal Oscillator in 3.2x2.5 SMD

## Net classes
0 signal: width 0.203 mm, drill 0.3 mm, clearance 0.203 mm
1 power: width 0.254 mm, drill 0.3 mm, clearance 0.203 mm

## Board
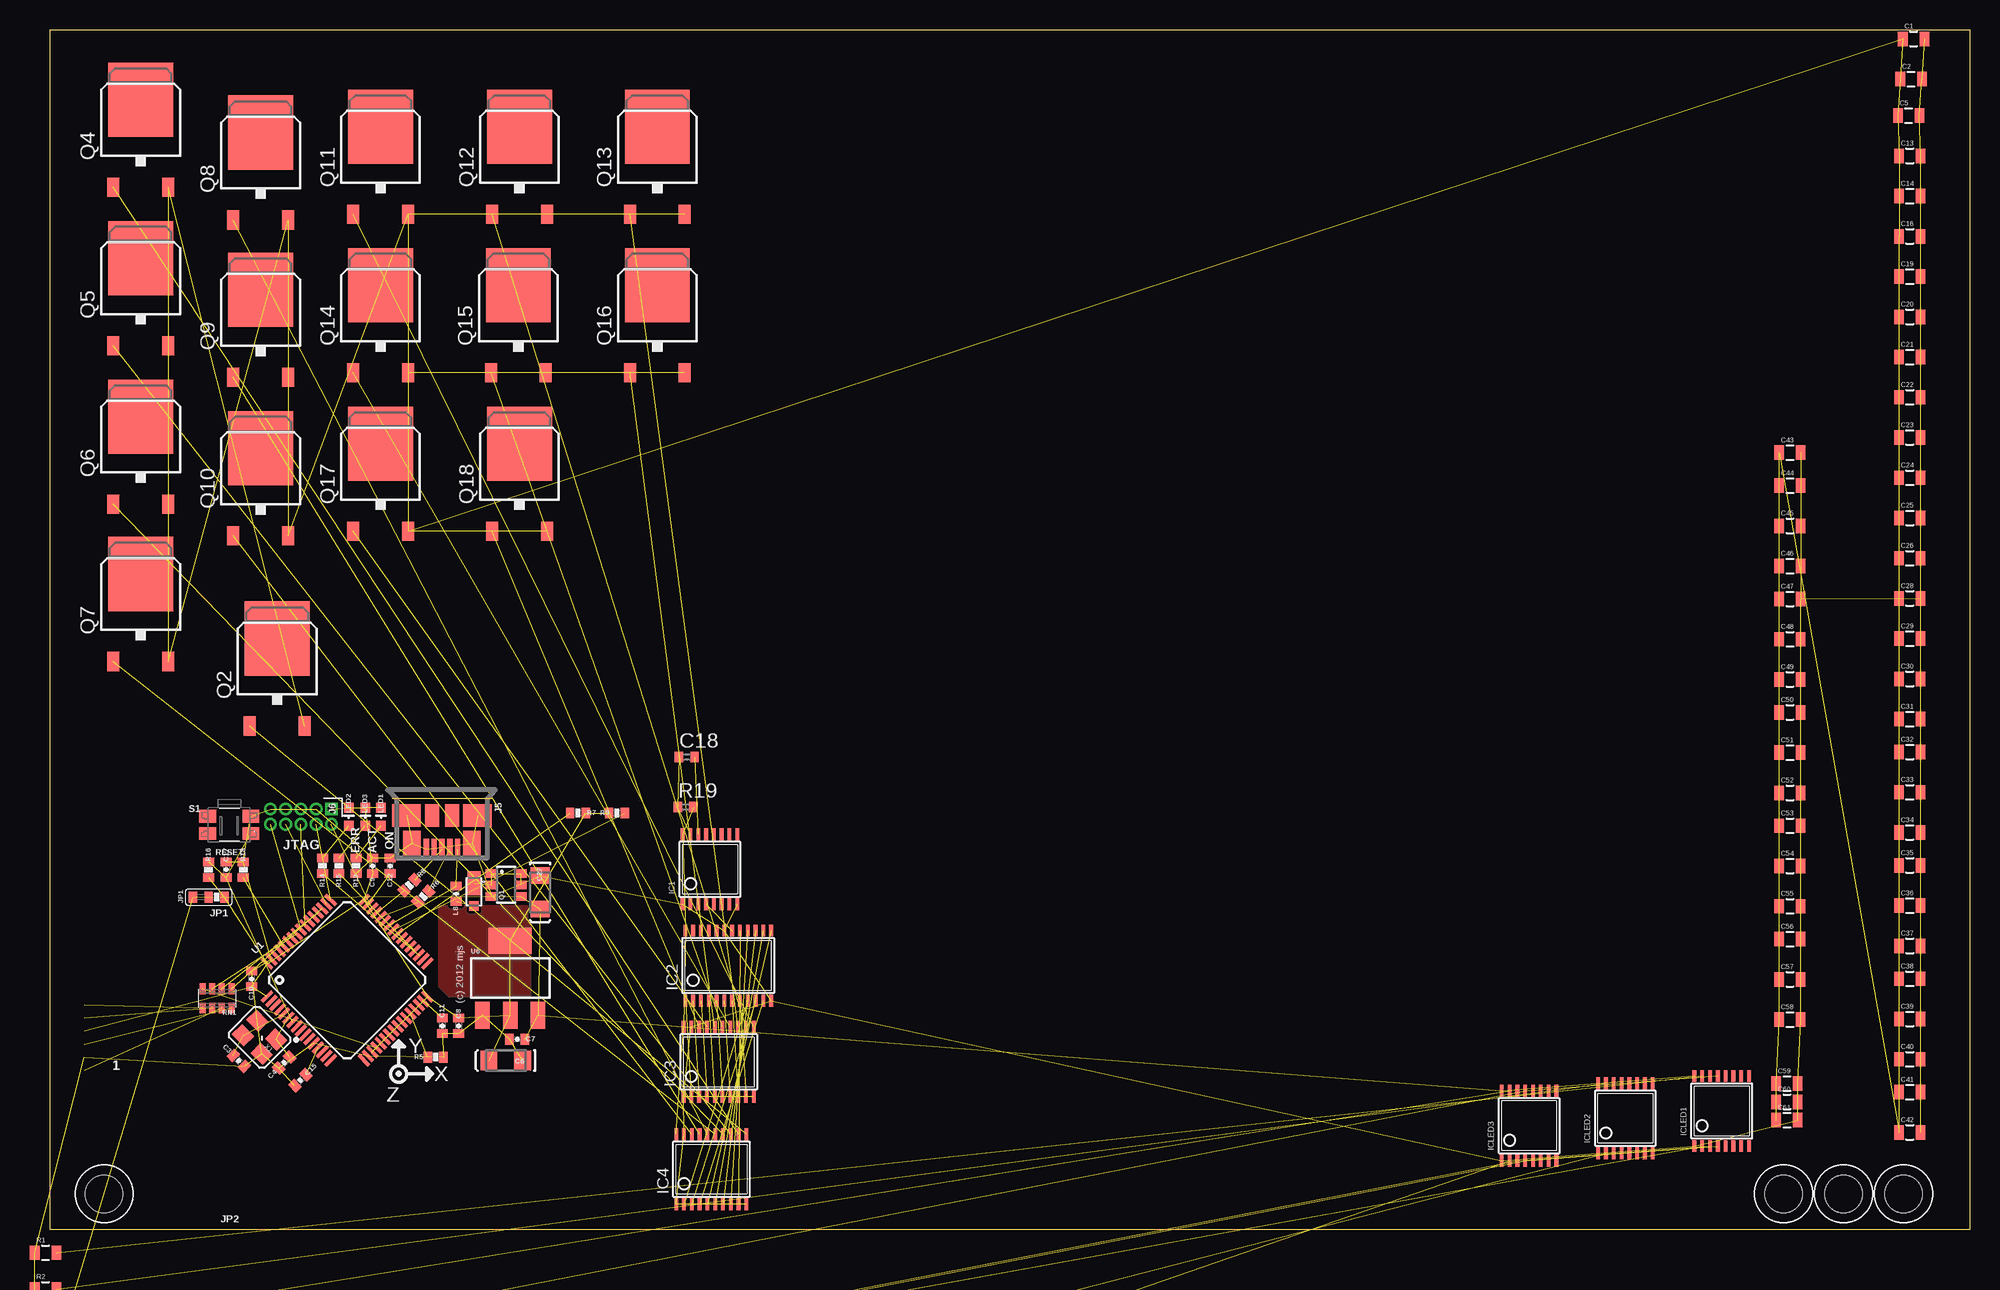
[diagram p4: board, top side]
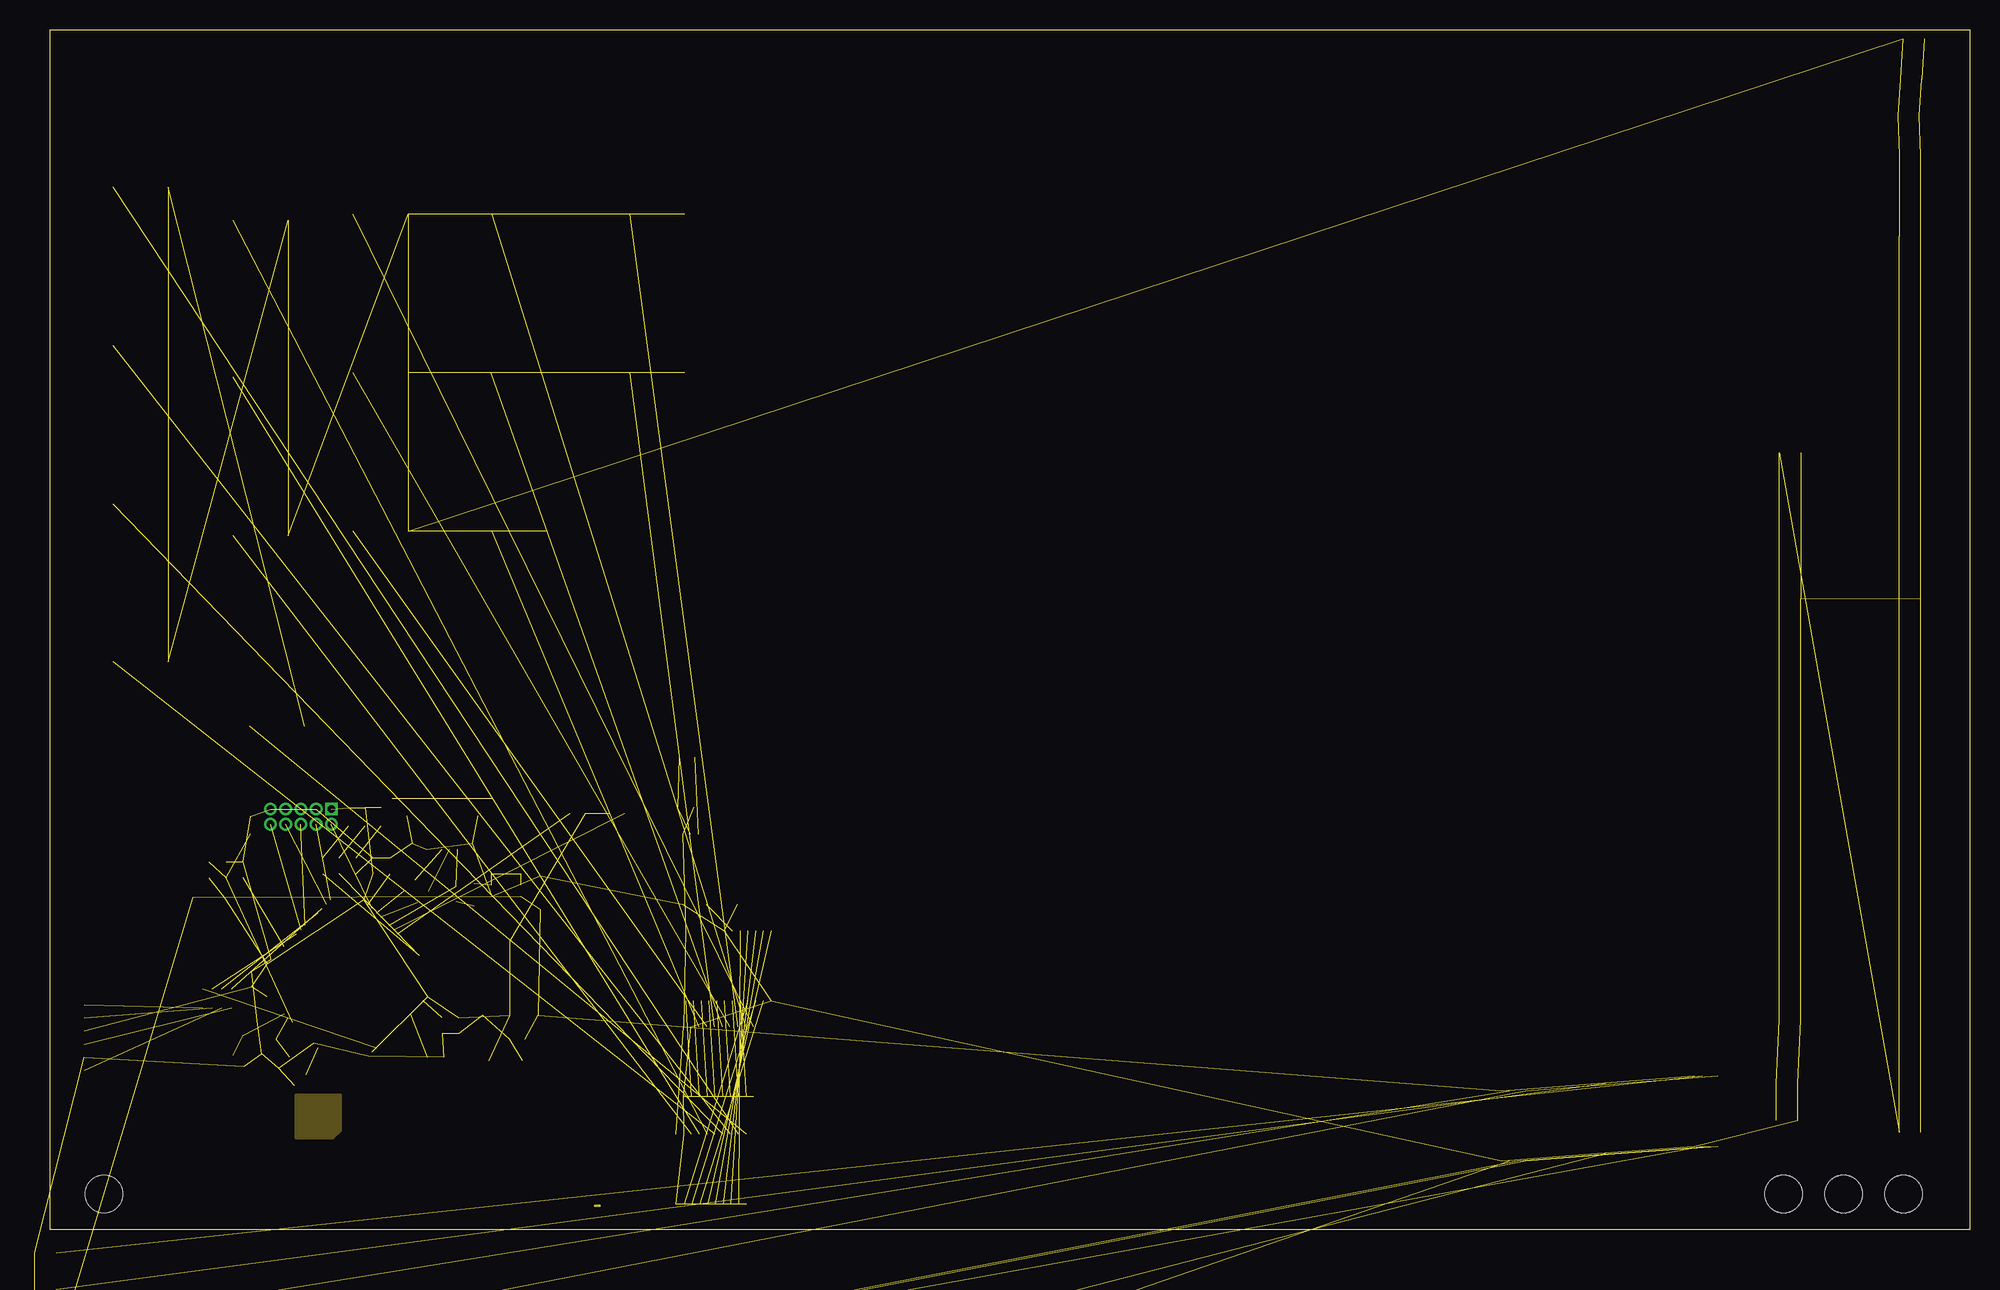
[diagram p5: board, inner layer Route2]
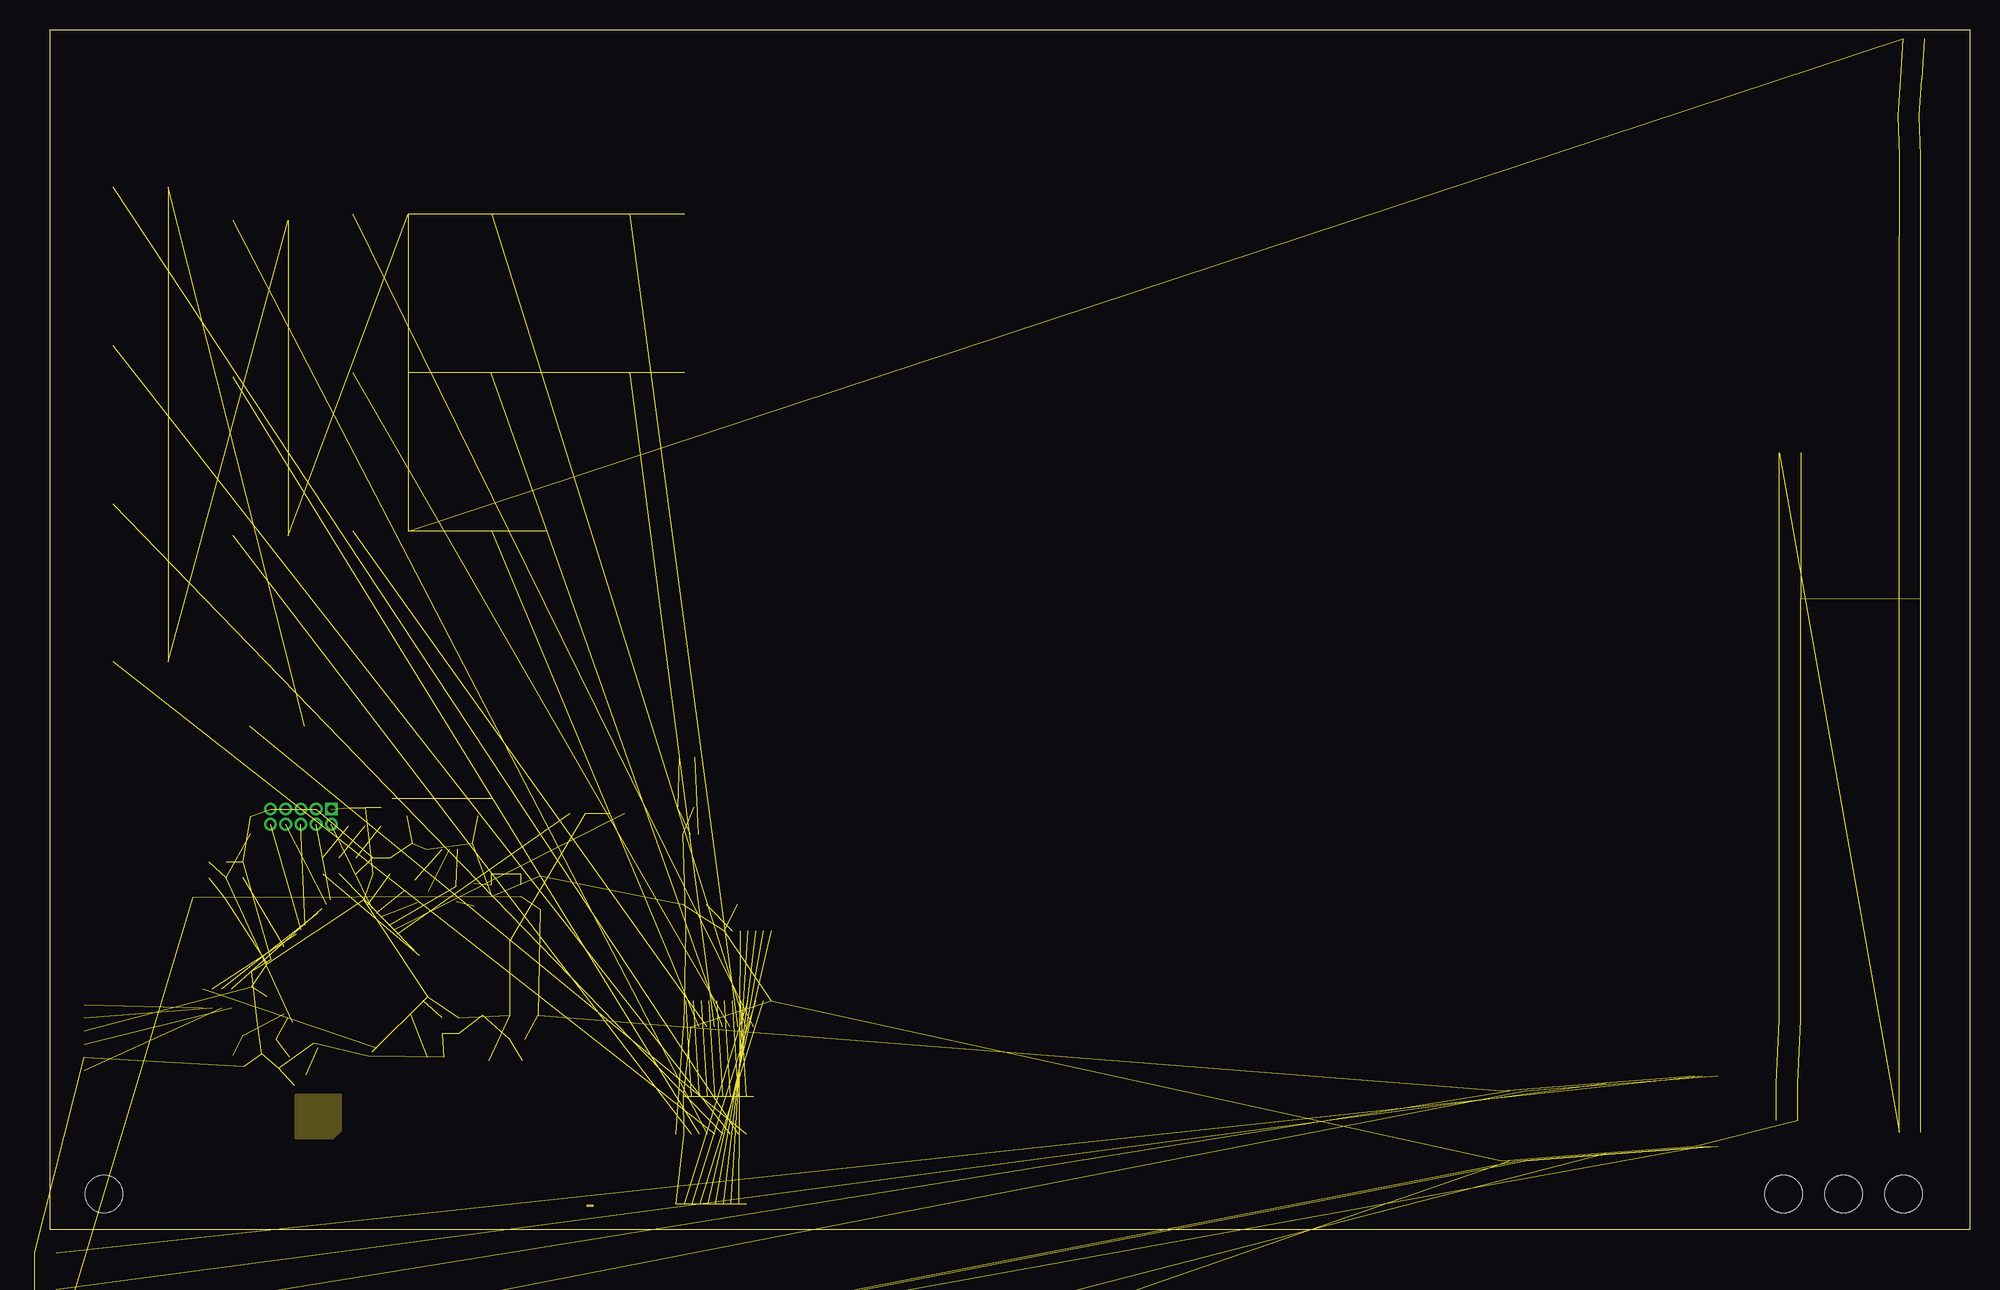
[diagram p6: board, inner layer Route15]
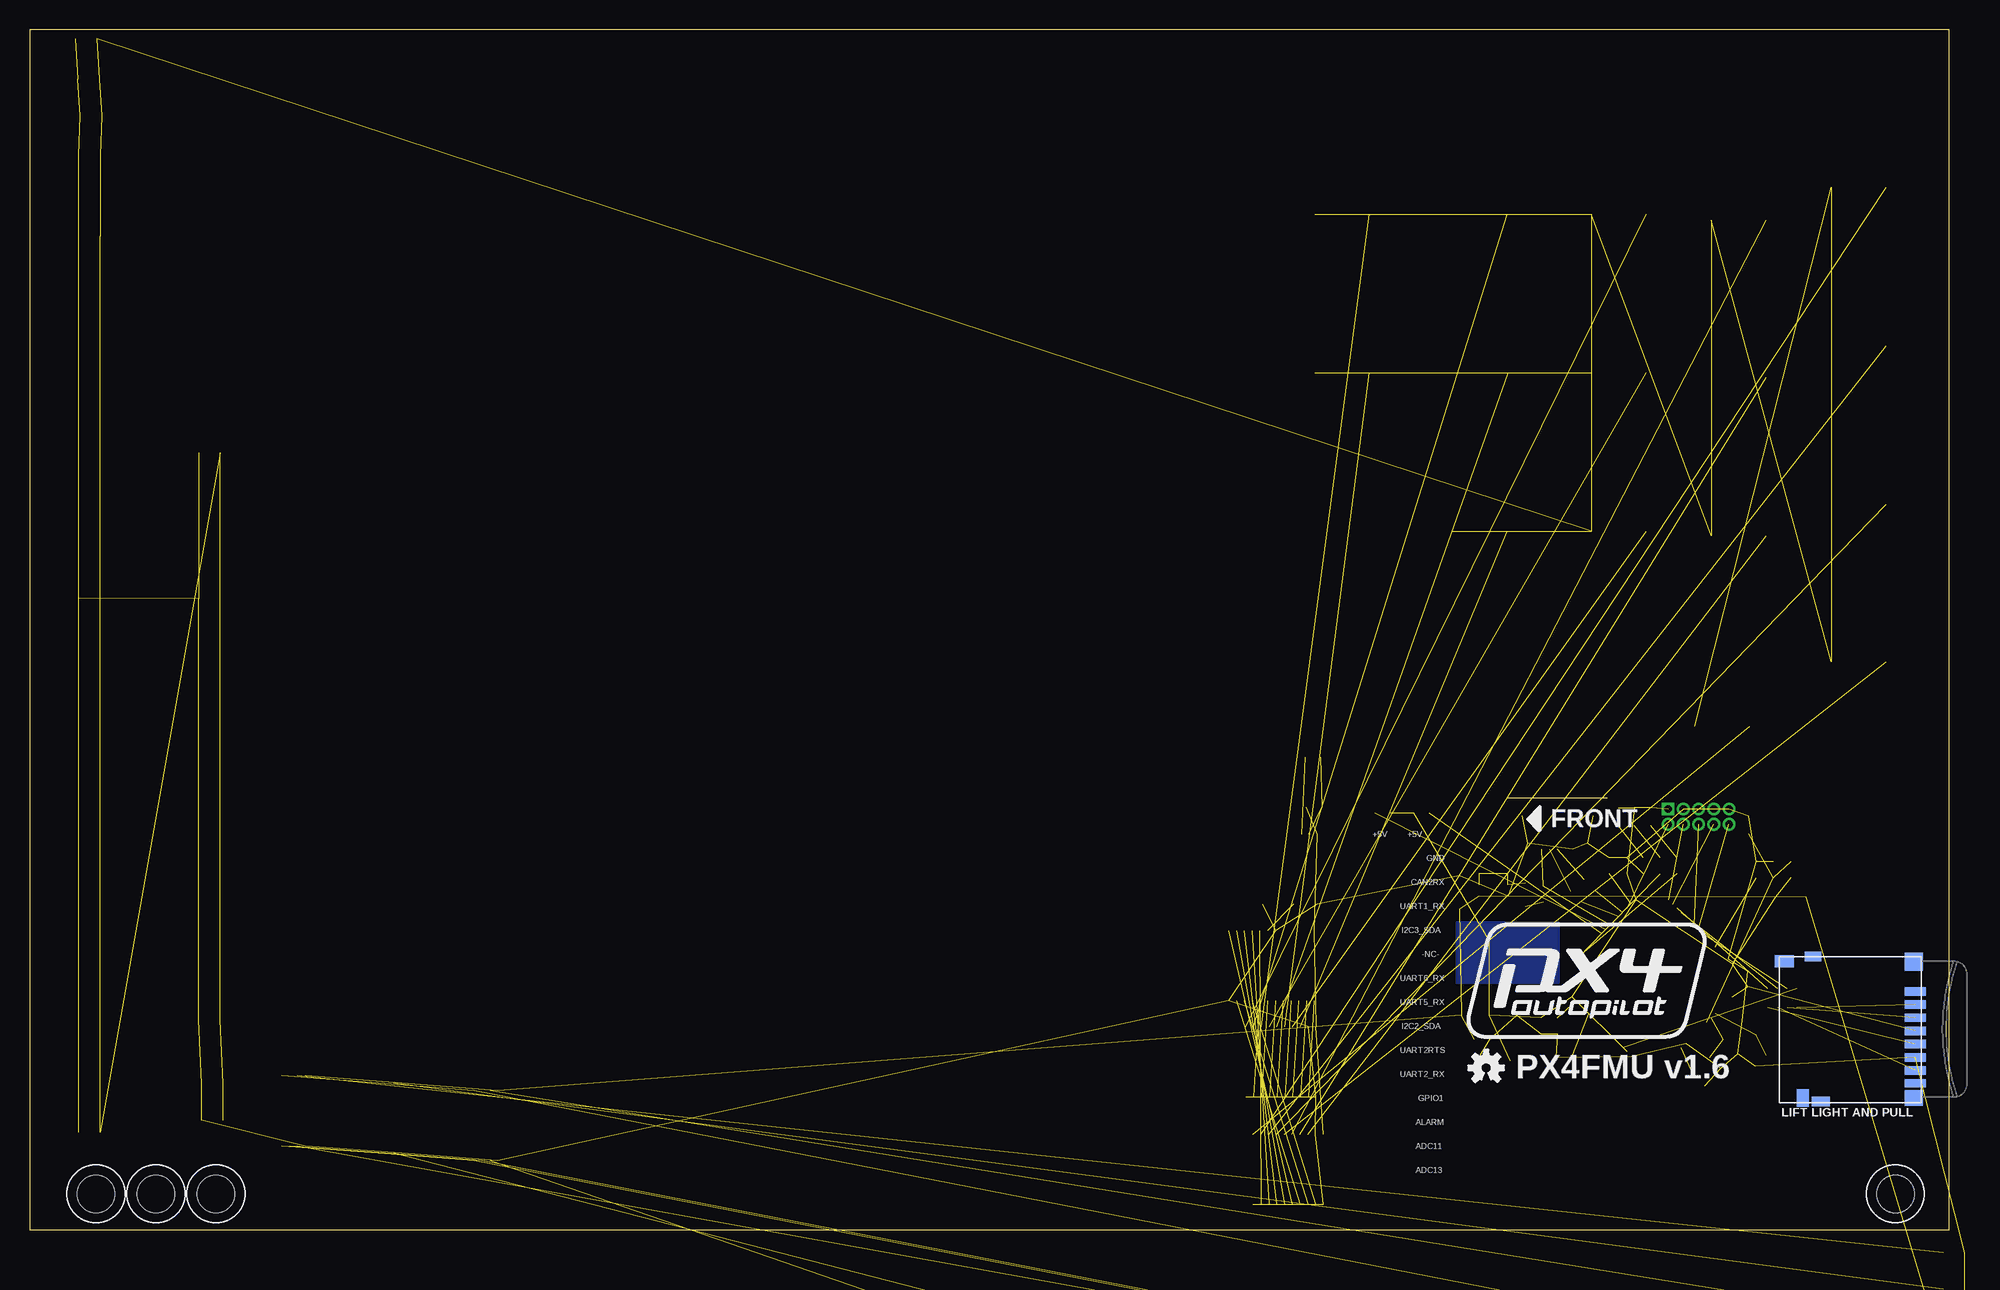
[diagram p7: board, bottom side, seen from below]

Size 160 x 100 mm. Coordinates in mm from the lower left corner, seen from the top.
Outline: 0,0 0,100 160,100 160,0 0,0
Copper layers (1*2*15*16): Top 0.035mm / dielectric 0.5mm / Route2 0.035mm / dielectric 0.5mm / Route15 0.035mm / dielectric 0.5mm / Bottom 0.035mm
Design rules "pixhawk2": minimum track width 0.15mm, minimum drill 0.3mm, track to track 0.15mm, track to pad 0.15mm, pad to pad 0.15mm, via to via 0.15mm, smd to smd 0.15mm, copper to edge 0.2mm, drill to drill 0.2mm, minimum pad ring 0.125mm, minimum via ring 0.125mm, stop-mask expansion 1mil, vias tented up to drill 0.31mm, thermal gap 8mil

### Footprints (pad centres in the part's own frame; a part is rotated, then mirrored left to right if it is on the bottom)
0805 = smd 0.8 x 1.2: 1 -0.9,0; 2 0.9,0
0402-CAP = smd 0.7 x 0.9: 1 -0.65,0; 2 0.65,0
EIA3216 = smd 1.4 x 1.6: A 1.4,0; C -1.4,0
C0402 = smd 0.7 x 0.9: 1 -0.65,0; 2 0.65,0
MICROSMP = smd 0.8 x 0.8: ANODE 0.65,0 | smd 2 x 1.1: CATHODE -1.25,0
TSSOP-16 = smd 0.305 x 0.991: 1 -2.275,-2.918; 2 -1.625,-2.918; 3 -0.975,-2.918; 4 -0.325,-2.918; 5 0.325,-2.918; 6 0.975,-2.918; 7 1.625,-2.918; 8 2.275,-2.918; 9 2.275,2.918; 10 1.625,2.918; 11 0.975,2.918; 12 0.325,2.918; 13 -0.325,2.918; 14 -0.975,2.918; 15 -1.625,2.918; 16 -2.275,2.918
TSSOP-24 = smd 0.305 x 0.991: 1 -3.575,-2.918; 2 -2.925,-2.918; 3 -2.275,-2.918; 4 -1.625,-2.918; 5 -0.975,-2.918; 6 -0.325,-2.918; 7 0.325,-2.918; 8 0.975,-2.918; 9 1.625,-2.918; 10 2.275,-2.918; 11 2.925,-2.918; 12 3.575,-2.918; 13 3.575,2.918; 14 2.925,2.918; 15 2.275,2.918; 16 1.625,2.918; 17 0.975,2.918; 18 0.325,2.918; 19 -0.325,2.918; 20 -0.975,2.918; 21 -1.625,2.918; 22 -2.275,2.918; 23 -2.925,2.918; 24 -3.575,2.918
TSSOP-20 = smd 0.305 x 0.991: 1 -2.305,-2.918; 2 -1.655,-2.918; 3 -1.005,-2.918; 4 -0.355,-2.918; 5 0.295,-2.918; 6 0.945,-2.918; 7 1.595,-2.918; 8 2.245,-2.918; 9 2.895,-2.918; 10 3.545,-2.918; 11 3.545,2.918; 12 2.895,2.918; 13 2.245,2.918; 14 1.595,2.918; 15 0.945,2.918; 16 0.295,2.918; 17 -0.355,2.918; 18 -1.005,2.918; 19 -1.655,2.918; 20 -2.305,2.918
MOLEX-47346-0001 = smd 1.7 x 0.44: D+ 2.8,0; D- 2.8,0.65; GND 2.8,-1.3; ID 2.8,-0.65; VBUS 2.8,1.3 | smd 1.9 x 2.375: GND1 0,2.95; GND4 0,-2.95 | smd 2.1 x 1.475: GND2 2.3,2.5; GND3 2.3,-2.5 | smd 1.9 x 1.175: GND5 0,-0.838; GND6 0,0.838
FTSH-105-01-XXX-DV = drill 0.65 pad 1.06 square: 1 0,0 | drill 0.65 pad 1.06 round: 2 0,1.27; 3 1.27,0; 4 1.27,1.27; 5 2.54,0; 6 2.54,1.27; 7 3.81,0; 8 3.81,1.27; 9 5.08,0; 10 5.08,1.27
SJ_3_0603_PASTE1&2 = smd 0.7 x 0.9: 1 -0.65,0; 2 0.65,0; 3 1.95,0
0402-IND = smd 0.7 x 0.9: 1 -0.65,0; 2 0.65,0
LED-0603 = smd 0.8 x 0.8: A 0,-0.75; C 0,0.75
TSOP-6@1 = smd 0.7 x 1: 1 -0.95,-1.2; 2 0,-1.2; 3 0.95,-1.2; 4 0.95,1.2; 5 0,1.2; 6 -0.95,1.2
D-PAK_TO252AA = smd 1 x 1.6: 1 -2.28,-4.8; 3 2.28,-4.8 | smd 5.4 x 6.2: 4 0,2.5
0402-RES = smd 0.7 x 0.9: 1 -0.65,0; 2 0.65,0
R0402 = smd 0.7 x 0.9: 1 -0.65,0; 2 0.65,0
CTS742C083 = smd 0.5 x 0.9: 1 -1.2,-0.8; 2 -0.4,-0.8; 3 0.4,-0.8; 4 1.2,-0.8; 5 1.2,0.8; 6 0.4,0.8; 7 -0.4,0.8; 8 -1.2,0.8
EVQP7J01K = smd 1.4 x 1.05: A1 -1.8,0.725; A2 1.8,0.725; B3 -1.8,-0.725; B4 1.8,-0.725
TQFP64 = smd 1.2 x 0.29: 1 -5.7,3.75; 2 -5.7,3.25; 3 -5.7,2.75; 4 -5.7,2.25; 5 -5.7,1.75; 6 -5.7,1.25; 7 -5.7,0.75; 8 -5.7,0.25; 9 -5.7,-0.25; 10 -5.7,-0.75; 11 -5.7,-1.25; 12 -5.7,-1.75; 13 -5.7,-2.25; 14 -5.7,-2.75; 15 -5.7,-3.25; 16 -5.7,-3.75; 33 5.7,-3.75; 34 5.7,-3.25; 35 5.7,-2.75; 36 5.7,-2.25; 37 5.7,-1.75; 38 5.7,-1.25; 39 5.7,-0.75; 40 5.7,-0.25; 41 5.7,0.25; 42 5.7,0.75; 43 5.7,1.25; 44 5.7,1.75; 45 5.7,2.25; 46 5.7,2.75; 47 5.7,3.25; 48 5.7,3.75 | smd 0.29 x 1.2: 17 -3.75,-5.7; 18 -3.25,-5.7; 19 -2.75,-5.7; 20 -2.25,-5.7; 21 -1.75,-5.7; 22 -1.25,-5.7; 23 -0.75,-5.7; 24 -0.25,-5.7; 25 0.25,-5.7; 26 0.75,-5.7; 27 1.25,-5.7; 28 1.75,-5.7; 29 2.25,-5.7; 30 2.75,-5.7; 31 3.25,-5.7; 32 3.75,-5.7; 49 3.75,5.7; 50 3.25,5.7; 51 2.75,5.7; 52 2.25,5.7; 53 1.75,5.7; 54 1.25,5.7; 55 0.75,5.7; 56 0.25,5.7; 57 -0.25,5.7; 58 -0.75,5.7; 59 -1.25,5.7; 60 -1.75,5.7; 61 -2.25,5.7; 62 -2.75,5.7; 63 -3.25,5.7; 64 -3.75,5.7
SOT-223 = smd 1.219 x 2.235: 1 -2.311,-3.099; 2 0,-3.099; 3 2.311,-3.099 | smd 3.6 x 2.2: 4 0,3.099
AMPHENOL_114-00841-68 = smd 0.7 x 1.75: P$1 7.7,-1; P$2 6.6,-1; P$3 5.5,-1; P$4 4.4,-1; P$5 3.3,-1; P$6 2.2,-1; P$7 1.1,-1; P$8 0.04,-1 | smd 1.5 x 1.5: P$9 10.15,-0.9 | smd 1.3 x 1.5: P$10 -1.2,-0.9 | smd 0.8 x 1.5: P$11 -1.5,6.85 | smd 1.45 x 1: P$12 -1.2,8.35 | smd 0.8 x 1.4: P$13 10.6,7.5 | smd 1 x 1.55: P$14 10.2,9.9
MOUNT-HOLE3.1 = hole 3.1: 0,0
OSCILLATOR-3.2X2.5 = smd 1.4 x 1.2: 1 -1.1,-0.85; 2 1.1,-0.85; 3 1.1,0.85; 4 -1.1,0.85

### Placement (x,y rotation side)
C1  155.33,99.26 0 top
C2  155.13,95.91 0 top
C3  15.72,14.09 315 top
C4  19.51,13.93 45 top
C5  154.93,92.86 0 top
C6  37.97,14.11 180 top
C7  38.94,15.89 180 top
C8  34.06,17.01 270 top
C9  26.87,30.34 90 top
C10  16.8,20.92 90 top
C11  32.69,17.01 270 top
C12  28.35,30.34 90 top
C13  155.03,89.51 0 top
C14  155.03,86.15 0 top
C15  20.86,12.47 225 top
C16  155.03,82.8 0 top
C17  14.68,30.01 270 top
C18  53.07,39.4 0 top
C19  155.03,79.45 0 top
C20  155.03,76.1 0 top
C21  155.03,72.74 0 top
C22  155.03,69.39 0 top
C23  155.03,66.04 0 top
C24  155.03,62.68 0 top
C25  155.03,59.33 0 top
C26  155.03,55.98 0 top
C27  40.84,28.14 270 top
C28  155.03,52.63 0 top
C29  155.03,49.27 0 top
C30  155.03,45.92 0 top
C31  155.03,42.57 0 top
C32  155.03,39.82 0 top
C33  155.03,36.47 0 top
C34  155.03,33.12 0 top
C35  155.03,30.38 0 top
C36  155.03,27.02 0 top
C37  155.03,23.67 0 top
C38  155.03,20.93 0 top
C39  155.03,17.57 0 top
C40  155.03,14.22 0 top
C41  155.03,11.48 0 top
C42  155.03,8.12 0 top
C43  145.03,64.77 0 top
C44  145.03,62.03 0 top
C45  145.03,58.68 0 top
C46  145.03,55.32 0 top
C47  145.03,52.58 0 top
C48  145.03,49.23 0 top
C49  145.03,45.87 0 top
C50  145.03,43.13 0 top
C51  145.03,39.78 0 top
C52  145.03,36.43 0 top
C53  145.03,33.68 0 top
C54  145.03,30.33 0 top
C55  145.03,26.98 0 top
C56  145.03,24.23 0 top
C57  145.03,20.88 0 top
C58  145.03,17.53 0 top
C59  144.78,12.19 0 top
C60  144.78,10.67 0 top
C61  144.78,9.14 0 top
D1  35.33,27.63 270 top
IC1  55,30.06 0 top
IC2  56.52,22.03 0 top
IC3  55.1,14 0 top
IC4  54.49,5.06 0 top
ICLED1  139.34,9.91 0 top
ICLED2  131.31,9.3 0 top
ICLED3  123.29,8.69 0 top
ICLED4  2.29,-14.86 0 top  (outside the outline)
ICLED5  2.29,-24 0 top  (outside the outline)
ICLED6  2.29,-33.15 0 top  (outside the outline)
ICLED7  2.29,-45.34 0 top  (outside the outline)
ICLED8  2.29,-54.48 0 top  (outside the outline)
ICLED9  2.29,-63.63 0 top  (outside the outline)
ICLED10  2.29,-75.82 0 top  (outside the outline)
ICLED11  10.67,-75.82 0 top  (outside the outline)
ICLED12  19.05,-75.82 0 top  (outside the outline)
ICLED13  2.29,-84.96 0 top  (outside the outline)
ICLED14  10.67,-84.96 0 top  (outside the outline)
ICLED15  19.05,-84.96 0 top  (outside the outline)
ICLED16  2.29,-94.11 0 top  (outside the outline)
ICLED17  10.67,-94.11 0 top  (outside the outline)
ICLED18  19.05,-94.11 0 top  (outside the outline)
ICLED19  2.29,-109.73 0 top  (outside the outline)
ICLED20  10.67,-109.73 0 top  (outside the outline)
ICLED21  2.29,-118.87 0 top  (outside the outline)
ICLED22  10.67,-118.87 0 top  (outside the outline)
ICLED23  2.29,-128.02 0 top  (outside the outline)
ICLED24  10.67,-128.02 0 top  (outside the outline)
J5  32.66,34.53 270 top
J6  23.44,35.07 180 top
JP1  13.87,27.73 180 top
L8  33.83,28.01 90 top
LED1  27.58,34.43 180 top
LED2  24.89,34.43 180 top
LED3  26.26,34.43 180 top
Q1  NTGS4111P  [TSOP-6@1]  38,28.74 270 top
Q2  18.93,46.79 0 top
Q4  7.55,91.69 0 top
Q5  7.55,78.48 0 top
Q6  7.55,65.27 0 top
Q7  7.55,52.17 0 top
Q8  17.55,88.96 0 top
Q9  17.55,75.85 0 top
Q10  17.55,62.64 0 top
Q11  27.55,89.44 0 top
Q12  39.13,89.44 0 top
Q13  50.61,89.44 0 top
Q14  27.55,76.23 0 top
Q15  39.03,76.23 0 top
Q16  50.61,76.23 0 top
Q17  27.55,63.02 0 top
Q18  39.13,63.02 0 top
R1  -0.38,-1.91 0 top
R2  -0.38,-4.95 0 top  (outside the outline)
R3  -0.38,-8 0 top  (outside the outline)
R4  8.38,-30.1 0 top  (outside the outline)
R5  32.13,14.39 0 top
R6  31.1,27.77 225 top
R7  43.99,34.74 0 top
R8  29.96,28.72 225 top
R9  47.24,34.74 180 top
R10  11.81,-30.1 0 top  (outside the outline)
R11  0,-39.24 0 top  (outside the outline)
R12  8.38,-60.58 0 top  (outside the outline)
R13  25.5,30.34 90 top
R14  22.71,30.34 90 top
R15  24.08,30.34 90 top
R16  13.21,30.01 270 top
R17  11.81,-60.58 0 top  (outside the outline)
R18  16.1,30.01 270 top
R19  52.97,35.24 0 top
R20  0,-69.72 0 top  (outside the outline)
R21  0,-100.2 0 top  (outside the outline)
R22  3.43,-100.2 0 top  (outside the outline)
R23  6.86,-100.2 0 top  (outside the outline)
R24  10.29,-100.2 0 top  (outside the outline)
R25  13.72,-100.2 0 top  (outside the outline)
R26  17.14,-100.2 0 top  (outside the outline)
R27  20.57,-100.2 0 top  (outside the outline)
R28  24,-100.2 0 top  (outside the outline)
R29  0,-103.63 0 top  (outside the outline)
R30  16.76,-124.97 0 top  (outside the outline)
R31  0,-134.11 0 top  (outside the outline)
R32  3.43,-134.11 0 top  (outside the outline)
R33  6.86,-134.11 0 top  (outside the outline)
R34  10.29,-134.11 0 top  (outside the outline)
R35  13.72,-134.11 0 top  (outside the outline)
RN1  13.92,19.3 180 top
S1  14.94,33.75 180 top
U1  24.77,20.82 45 top
U6  38.35,21 0 top
U13  3.86,12.18 90 bottom
U$1  154.5,3 0 top
U$2  144.5,3 0 top
U$3  4.5,3 0 top
U$4  149.5,3 0 top
U$7  38.61,13.5 0 bottom
U$13  40.23,15.95 0 bottom
X1  17.45,16.04 135 top

### Tracks (layer width: path | path; a pad name or v marks a point on that pad's centre or on a via)
!JTRST  (1 unrouted)
BOOT0  (1 unrouted)
E_FET0  (1 unrouted)
E_FET1  (1 unrouted)
E_FET2  (1 unrouted)
E_FET3  (1 unrouted)
E_FET4  (1 unrouted)
E_FET5  (1 unrouted)
E_FET6  (1 unrouted)
E_FET7  (1 unrouted)
E_FET8  (1 unrouted)
E_FET9  (1 unrouted)
E_FET10  (1 unrouted)
E_FET11  (1 unrouted)
E_FET12  (1 unrouted)
E_FET13  (1 unrouted)
E_FET14  (1 unrouted)
E_FET15  (1 unrouted)
GND  (137 unrouted)
I2C3_SCL  (1 unrouted)
I2C3_SDA  (1 unrouted)
JTCK-SWCLK  (1 unrouted)
JTDI  (1 unrouted)
JTDO  (1 unrouted)
JTMS-SWDIO  (1 unrouted)
LED_AMBER  (1 unrouted)
LED_BLUE  (1 unrouted)
LED_CLK  (23 unrouted)
LED_I_B0  (7 unrouted)
LED_I_G0  (7 unrouted)
LED_I_R0  (7 unrouted)
LED_LE  (23 unrouted)
LED_OE  (23 unrouted)
N$1  (2 unrouted)
N$2  (2 unrouted)
N$3  (1 unrouted)
N$4  (1 unrouted)
N$5  (1 unrouted)
N$6  (1 unrouted)
N$7  (1 unrouted)
N$8  (1 unrouted)
N$9  (1 unrouted)
N$10  (1 unrouted)
N$11  (1 unrouted)
N$12  (1 unrouted)
N$13  (1 unrouted)
N$14  (1 unrouted)
N$15  (1 unrouted)
N$16  (1 unrouted)
N$17  (1 unrouted)
N$18  (1 unrouted)
N$19  (1 unrouted)
N$20  (1 unrouted)
N$21  (1 unrouted)
N$22  (1 unrouted)
N$23  (1 unrouted)
N$24  (1 unrouted)
N$25  (1 unrouted)
N$26  (1 unrouted)
N$27  (1 unrouted)
N$28  (1 unrouted)
N$29  (1 unrouted)
N$30  (1 unrouted)
N$31  (1 unrouted)
N$32  (1 unrouted)
N$33  (1 unrouted)
N$34  (1 unrouted)
N$35  (1 unrouted)
N$36  (1 unrouted)
N$37  (1 unrouted)
N$38  (1 unrouted)
N$39  (1 unrouted)
N$40  (1 unrouted)
N$41  (1 unrouted)
N$42  (1 unrouted)
N$43  (1 unrouted)
N$44  (1 unrouted)
N$45  (1 unrouted)
N$46  (1 unrouted)
N$47  (2 unrouted)
N$48  (1 unrouted)
N$49  (1 unrouted)
N$50  (1 unrouted)
N$51  (1 unrouted)
N$52  (1 unrouted)
N$53  (1 unrouted)
OTG_DM  (1 unrouted)
OTG_DP  (1 unrouted)
OTG_FS_DM  (1 unrouted)
OTG_FS_DP  (1 unrouted)
PB2-BOOT1  (1 unrouted)
POLY1
  Route15 0.203: 44.81,2.03 45.21,2.03
  pour Route2 (rank 2): 20.52,11.28 24.18,11.28 24.18,8.23 23.57,7.62 20.52,7.62
POLY2
  Route2 0.203: 45.41,2.03 45.82,2.03
  pour Route15: 20.52,11.28 24.18,11.28 24.18,8.23 23.57,7.62 20.52,7.62
RESET  (3 unrouted)
SPI3_MISO  (1 unrouted)
SPI3_MOSI  (1 unrouted)
SPI3_NSS  (1 unrouted)
SPI3_SCK  (1 unrouted)
VBUS  (2 unrouted)
VCAP_1  (1 unrouted)
VCAP_2  (1 unrouted)
VCC  (63 unrouted)
VDD_3V3  (19 unrouted)
  pour Top (no thermals): 40.03,26.92 32.41,26.92 32.41,20.31 33.22,19.5 40.03,19.5
  pour Bottom: 32.61,20.62 32.61,25.6 41.05,25.6 41.05,20.62
VDD_3V3_ANALOG  (1 unrouted)
VDD_5V  (33 unrouted)
VDD_5V_IN  (4 unrouted)

### Text on the board
tPlace: RESET | JTAG | ON | ERR | ACT | JP1 | (c) 2012 mjs | Y | 1 | X | Z | JP2
bPlace: FRONT | +5V | +5V | GND | CAN2RX | UART1_RX | I2C3_SDA | -NC- | UART6_RX | UART5_RX | I2C2_SDA | UART2RTS | PX4FMU v1.6 | UART2_RX | GPIO1 | LIFT LIGHT AND PULL | ALARM | ADC11 | ADC13
tDocu: 5.0V | 5.0V | 3.3V | 3.3V